# EAGLE schematic mother-002 (EAGLE 4.16)

## Sheet 1 of 15
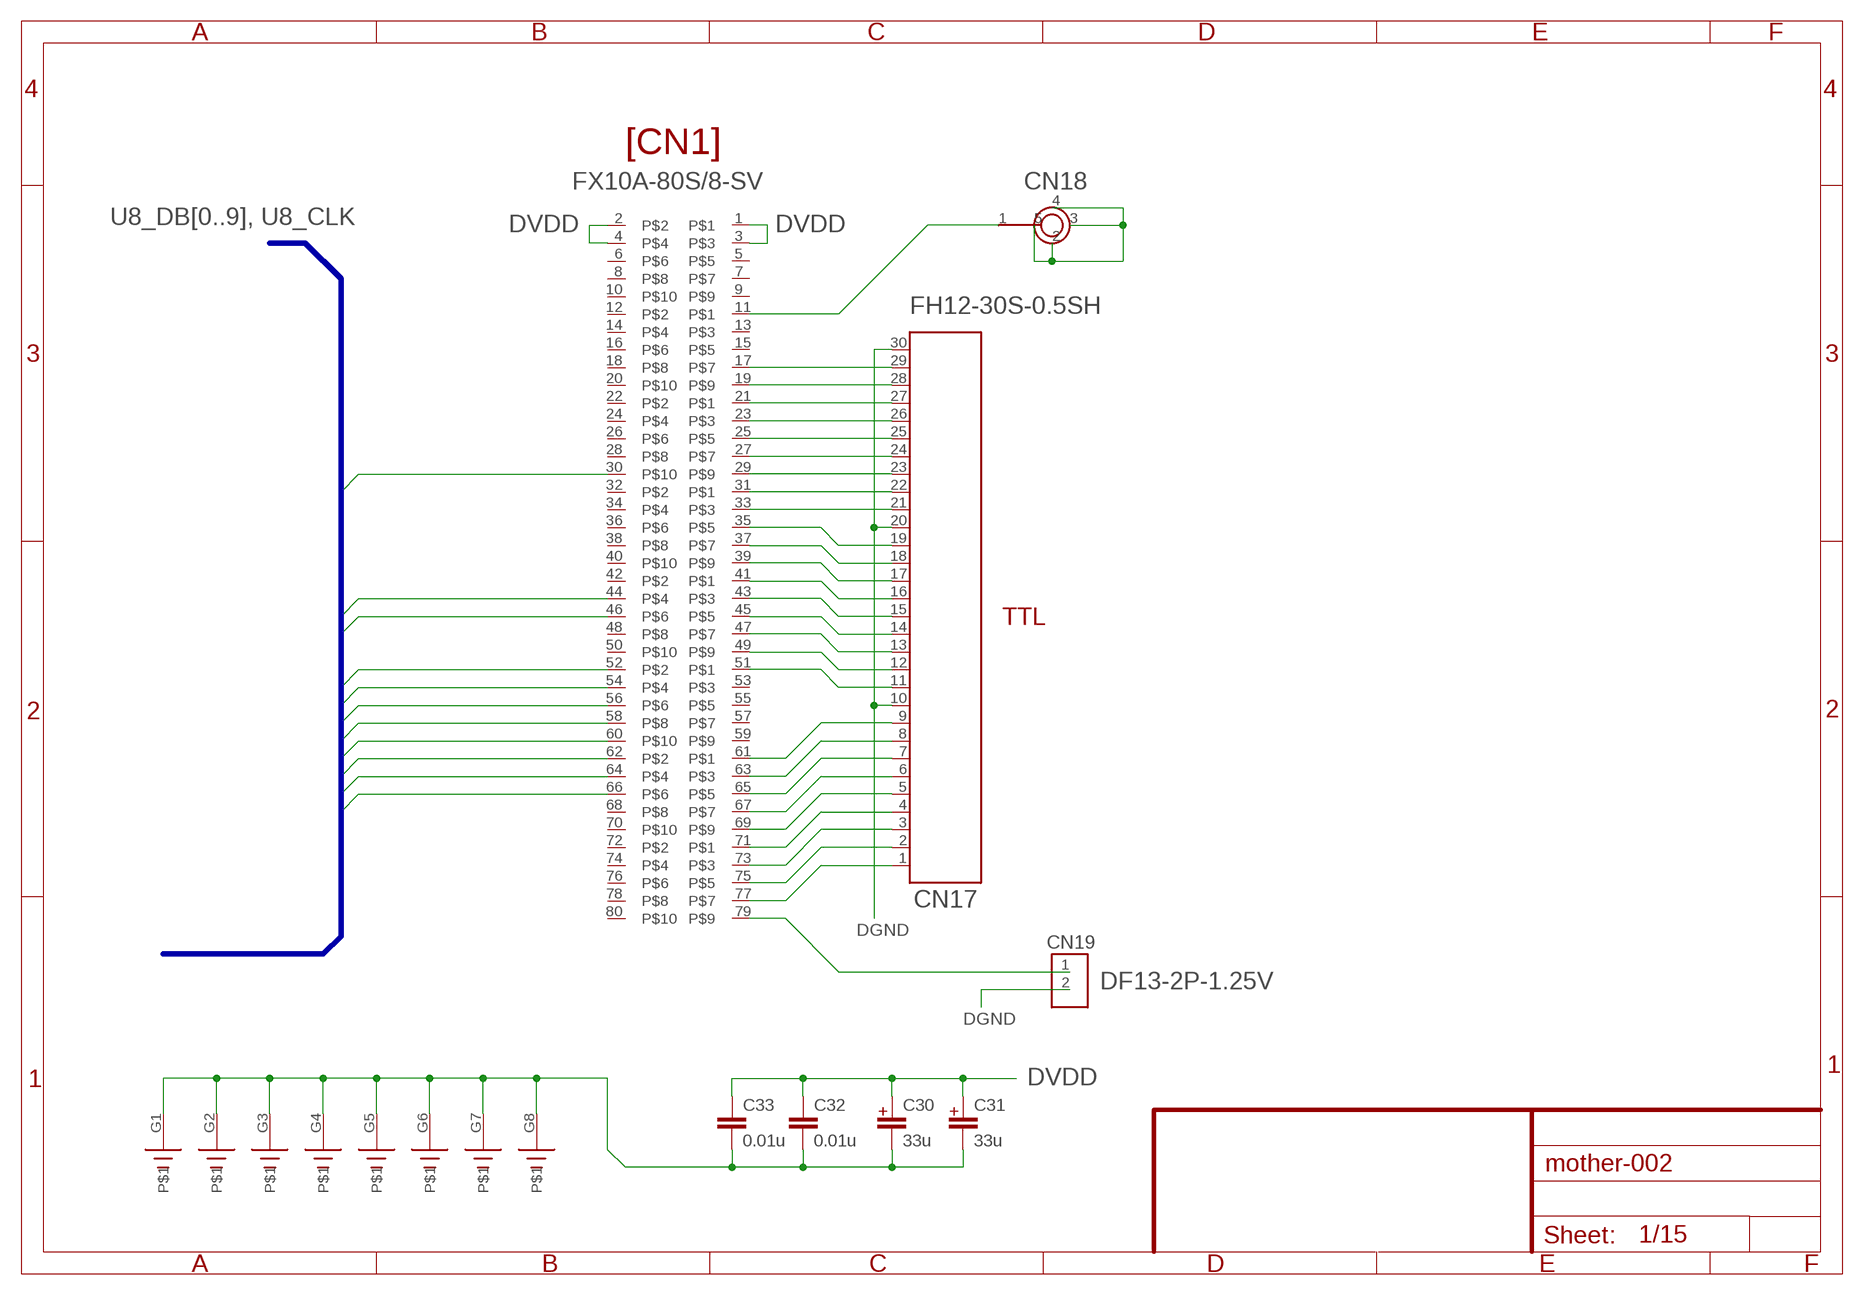
[diagram p0: schematic, sheet 1]

### Parts
C30  33u  C_POLAR  [3216_POLAR]
C31  33u  C_POLAR  [3216_POLAR]
C32  0.01u  C1608  [1608]
C33  0.01u  C1608  [1608]
CN1  FX10A-80S/8-SV  [FX10A-80S/8-SV]
CN17  FH12-30S-0.5SH  [FPC_30]
CN18  SMASTRAIGHT  [SMA_STRAIGHT]
CN19  DF13-2P-1.25V  [DF13-2P-12.5V]

### Nets
AGND: CN18.2(GND) CN18.3(GND) CN18.4(GND) CN18.5(GND) ; also sheet 3,6,7,8,9,10,11,13,14
DGND: C30.P$2 C31.P$2 C32.2 C33.2 CN1.G1 CN1.G2 CN1.G3 CN1.G4 CN1.G5 CN1.G6 CN1.G7 CN1.G8 CN17.10 CN17.20 CN17.30 CN19.2 ; also sheet 2,3,4,5,6,7,8,9,10,11,12,13,14
DVDD: C30.P$1 C31.P$1 C32.1 C33.1 CN1.1 CN1.2 CN1.3 CN1.4 ; also sheet 2,3,4,6,7,8,9,10,11,13,14
N$40: CN1.17 CN17.29
N$41: CN1.19 CN17.28
N$42: CN1.21 CN17.27
N$43: CN1.23 CN17.26
N$44: CN1.25 CN17.25
N$45: CN1.27 CN17.24
N$46: CN1.29 CN17.23
N$47: CN1.31 CN17.22
N$48: CN1.33 CN17.21
N$49: CN1.35 CN17.19
N$50: CN1.37 CN17.18
N$51: CN1.39 CN17.17
N$52: CN1.41 CN17.16
N$53: CN1.43 CN17.15
N$54: CN1.45 CN17.14
N$55: CN1.47 CN17.13
N$56: CN1.49 CN17.12
N$57: CN1.51 CN17.11
N$58: CN1.61 CN17.9
N$59: CN1.63 CN17.8
N$60: CN1.65 CN17.7
N$61: CN1.67 CN17.6
N$62: CN1.69 CN17.5
N$63: CN1.71 CN17.4
N$64: CN1.73 CN17.3
N$65: CN1.75 CN17.2
N$66: CN1.77 CN17.1
N$68: CN1.11 CN18.1
N$69: CN1.79 CN19.1
U8_CLK: CN1.30 ; also sheet 14
U8_DB0: CN1.44 ; also sheet 14
U8_DB1: CN1.46 ; also sheet 14
U8_DB2: CN1.52 ; also sheet 14
U8_DB3: CN1.54 ; also sheet 14
U8_DB4: CN1.56 ; also sheet 14
U8_DB5: CN1.58 ; also sheet 14
U8_DB6: CN1.60 ; also sheet 14
U8_DB7: CN1.62 ; also sheet 14
U8_DB8: CN1.64 ; also sheet 14
U8_DB9: CN1.66 ; also sheet 14
Unconnected: CN1.5 CN1.6 CN1.7 CN1.8 CN1.9 CN1.10 CN1.12 CN1.13 CN1.14 CN1.15 CN1.16 CN1.18 CN1.20 CN1.22 CN1.24 CN1.26 CN1.28 CN1.32 CN1.34 CN1.36 CN1.38 CN1.40 CN1.42 CN1.48 CN1.50 CN1.53 CN1.55 CN1.57 CN1.59 CN1.68 CN1.70 CN1.72 CN1.74 CN1.76 CN1.78 CN1.80

### Buses
U8_DB[0..9],U8_CLK

### Notes on the sheet
- [CN1]
- FX10A-80S/8-SV
- U8_DB[0..9], U8_CLK
- DVDD | DVDD
- TTL
- DGND
- DGND
- DVDD

## Sheet 2 of 15
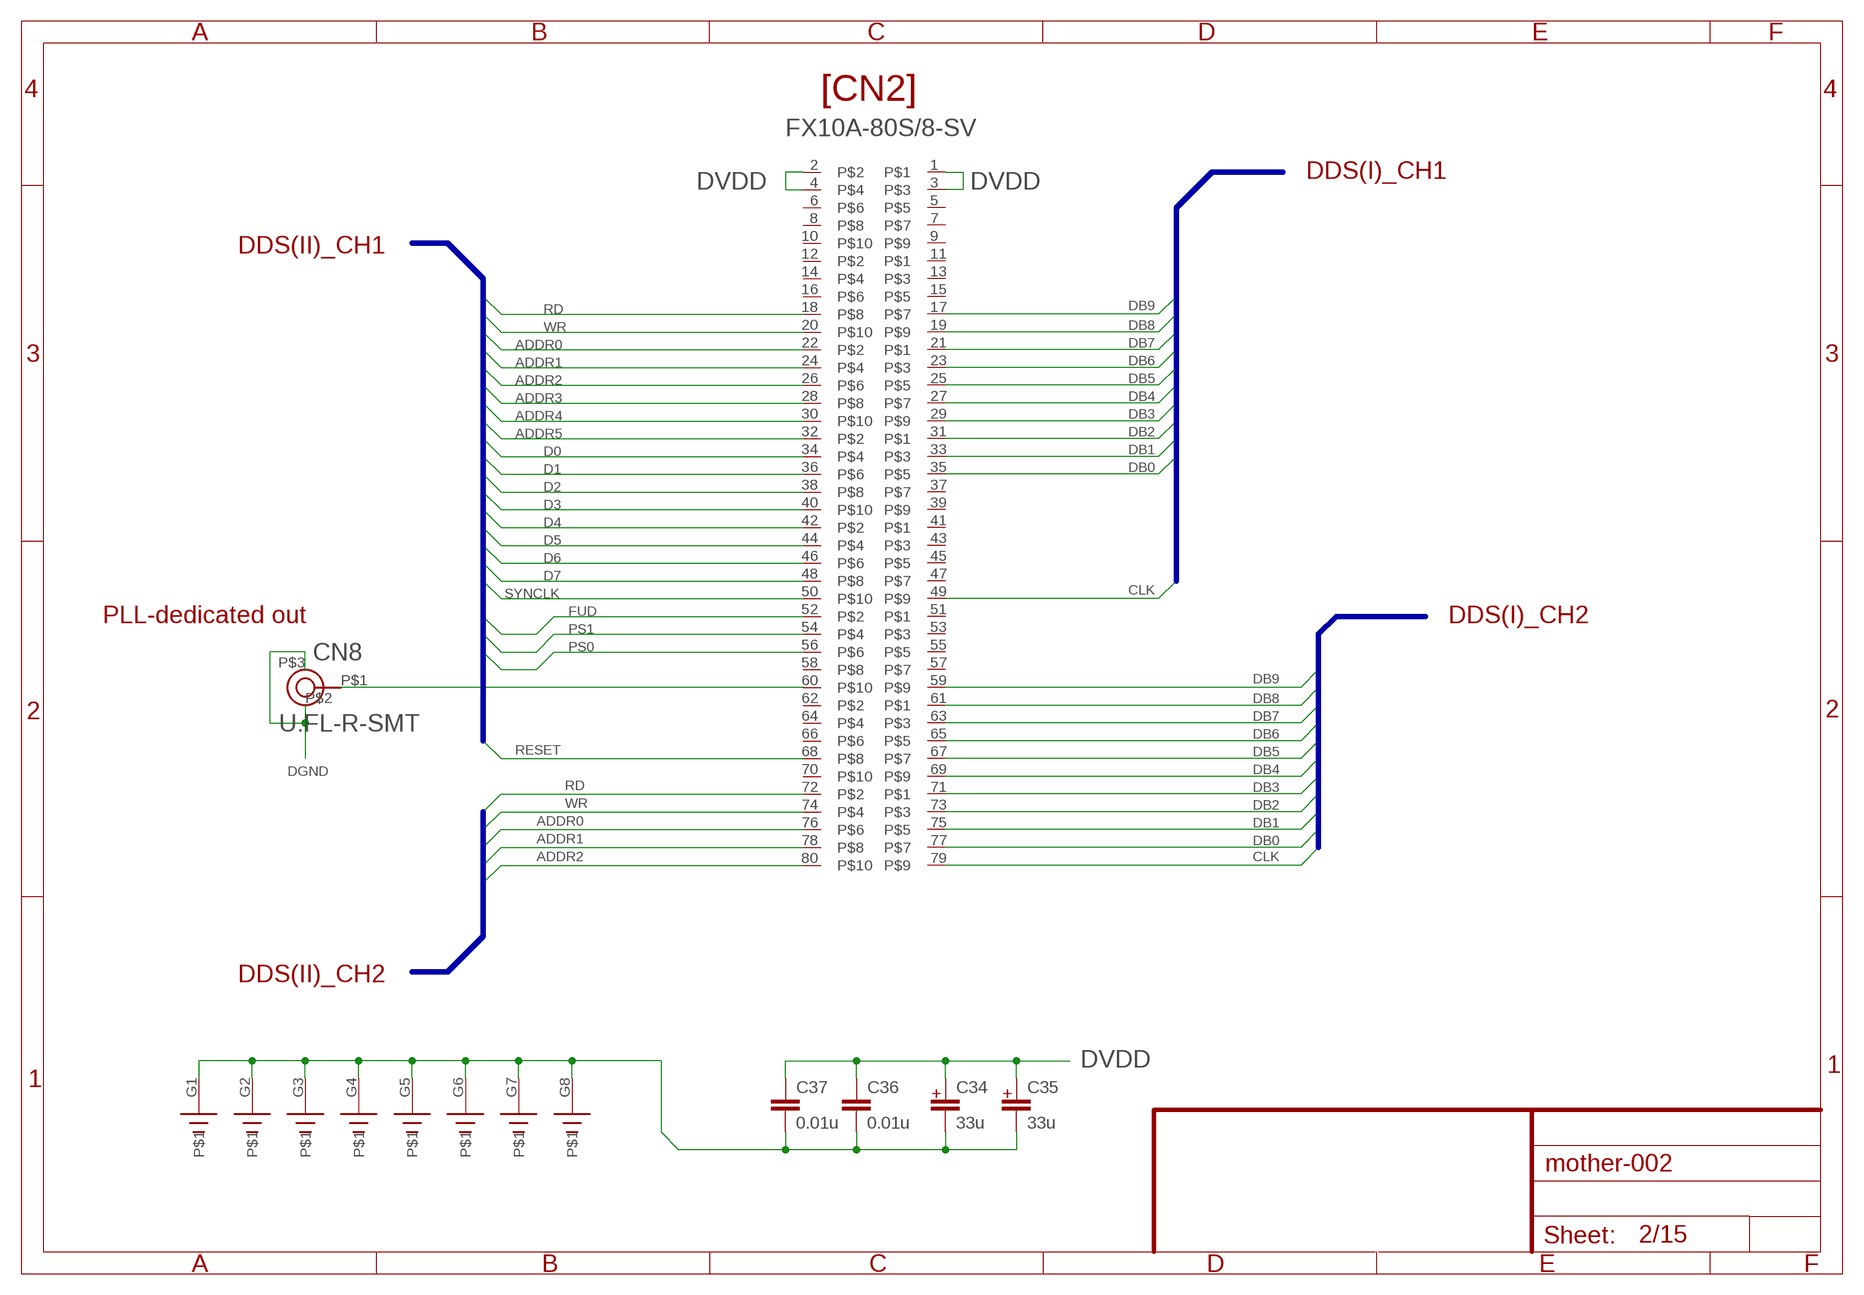
[diagram p1: schematic, sheet 2]

### Parts
C34  33u  C_POLAR  [3216_POLAR]
C35  33u  C_POLAR  [3216_POLAR]
C36  0.01u  C1608  [1608]
C37  0.01u  C1608  [1608]
CN2  FX10A-80S/8-SV  [FX10A-80S/8-SV]
CN8  U.FL-R-SMT  [U.FL-R-SMT]

### Nets
DDS2CH1_ADDR0: CN2.22 ; also sheet 12
DDS2CH1_ADDR1: CN2.24 ; also sheet 12
DDS2CH1_ADDR2: CN2.26 ; also sheet 12
DDS2CH1_ADDR3: CN2.28 ; also sheet 12
DDS2CH1_ADDR4: CN2.30 ; also sheet 12
DDS2CH1_ADDR5: CN2.32 ; also sheet 12
DDS2CH1_D0: CN2.34 ; also sheet 12
DDS2CH1_D1: CN2.36 ; also sheet 12
DDS2CH1_D2: CN2.38 ; also sheet 12
DDS2CH1_D3: CN2.40 ; also sheet 12
DDS2CH1_D4: CN2.42 ; also sheet 12
DDS2CH1_D5: CN2.44 ; also sheet 12
DDS2CH1_D6: CN2.46 ; also sheet 12
DDS2CH1_D7: CN2.48 ; also sheet 12
DDS2CH1_FUD: CN2.52 ; also sheet 12
DDS2CH1_PS0: CN2.56 ; also sheet 12
DDS2CH1_PS1: CN2.54 ; also sheet 12
DDS2CH1_RD: CN2.18 ; also sheet 12
DDS2CH1_RST: CN2.68 ; also sheet 12
DDS2CH1_SYNCLK: CN2.50 ; also sheet 12
DDS2CH1_WR: CN2.20 ; also sheet 12
DDS2CH2_ADDR0: CN2.76 ; also sheet 12
DDS2CH2_ADDR1: CN2.78 ; also sheet 12
DDS2CH2_ADDR2: CN2.80 ; also sheet 12
DDS2CH2_RD: CN2.72 ; also sheet 12
DDS2CH2_WR: CN2.74 ; also sheet 12
DGND: C34.P$2 C35.P$2 C36.2 C37.2 CN2.G1 CN2.G2 CN2.G3 CN2.G4 CN2.G5 CN2.G6 CN2.G7 CN2.G8 CN8.P$2(AGND) CN8.P$3(AGND2) ; also sheet 1,3,4,5,6,7,8,9,10,11,12,13,14
DVDD: C34.P$1 C35.P$1 C36.1 C37.1 CN2.1 CN2.2 CN2.3 CN2.4 ; also sheet 1,3,4,6,7,8,9,10,11,13,14
N$13: CN2.60 CN8.P$1
U1_CLK: CN2.49 ; also sheet 6
U1_DB0: CN2.35 ; also sheet 6
U1_DB1: CN2.33 ; also sheet 6
U1_DB2: CN2.31 ; also sheet 6
U1_DB3: CN2.29 ; also sheet 6
U1_DB4: CN2.27 ; also sheet 6
U1_DB5: CN2.25 ; also sheet 6
U1_DB6: CN2.23 ; also sheet 6
U1_DB7: CN2.21 ; also sheet 6
U1_DB8: CN2.19 ; also sheet 6
U1_DB9: CN2.17 ; also sheet 6
U2_CLK: CN2.79 ; also sheet 7
U2_DB0: CN2.77 ; also sheet 7
U2_DB1: CN2.75 ; also sheet 7
U2_DB2: CN2.73 ; also sheet 7
U2_DB3: CN2.71 ; also sheet 7
U2_DB4: CN2.69 ; also sheet 7
U2_DB5: CN2.67 ; also sheet 7
U2_DB6: CN2.65 ; also sheet 7
U2_DB7: CN2.63 ; also sheet 7
U2_DB8: CN2.61 ; also sheet 7
U2_DB9: CN2.59 ; also sheet 7
Unconnected: CN2.5 CN2.6 CN2.7 CN2.8 CN2.9 CN2.10 CN2.11 CN2.12 CN2.13 CN2.14 CN2.15 CN2.16 CN2.37 CN2.39 CN2.41 CN2.43 CN2.45 CN2.47 CN2.51 CN2.53 CN2.55 CN2.57 CN2.58 CN2.62 CN2.64 CN2.66 CN2.70

### Buses
BUS1:U1_DB[0..9],U1_CLK
DDS2CH1_RST,DDS2CH1_PS[0..1],DDS2CH1_FUD,DDS2CH1_SYNCLK,DDS2CH1_D[0..7],DDS2CH1_ADDR[0..5],DDS2CH1_WR,DDS2CH1_RD
U2_DB[0..9],U2_CLK
DDS2CH2_RST,DDS2CH2_PS[0..1],DDS2CH2_FUD,DDS2CH2_SYNCLK,DDS2CH2_D[0..7],DDS2CH2_ADDR[0..5],DDS2CH2_WR,DDS2CH2_RD

### Notes on the sheet
- [CN2]
- FX10A-80S/8-SV
- DDS(I)_CH1
- DVDD | DVDD
- DDS(II)_CH1
- RD | DB9
- WR | DB8
- ADDR0 | DB7
- ADDR1 | DB6
- ADDR2 | DB5
- ADDR3 | DB4
- ADDR4 | DB3
- ADDR5 | DB2
- D0 | DB1
- D1 | DB0
- D2
- D3
- D4
- D5
- D6
- D7
- SYNCLK | CLK
- FUD
- PLL-dedicated out | DDS(I)_CH2
- PS1
- PS0
- DB9
- DB8
- DB7
- DB6
- RESET | DB5
- DGND | DB4
- RD | DB3
- WR | DB2
- ADDR0 | DB1
- ADDR1 | DB0
- ADDR2 | CLK
- DDS(II)_CH2
- DVDD

## Sheet 3 of 15
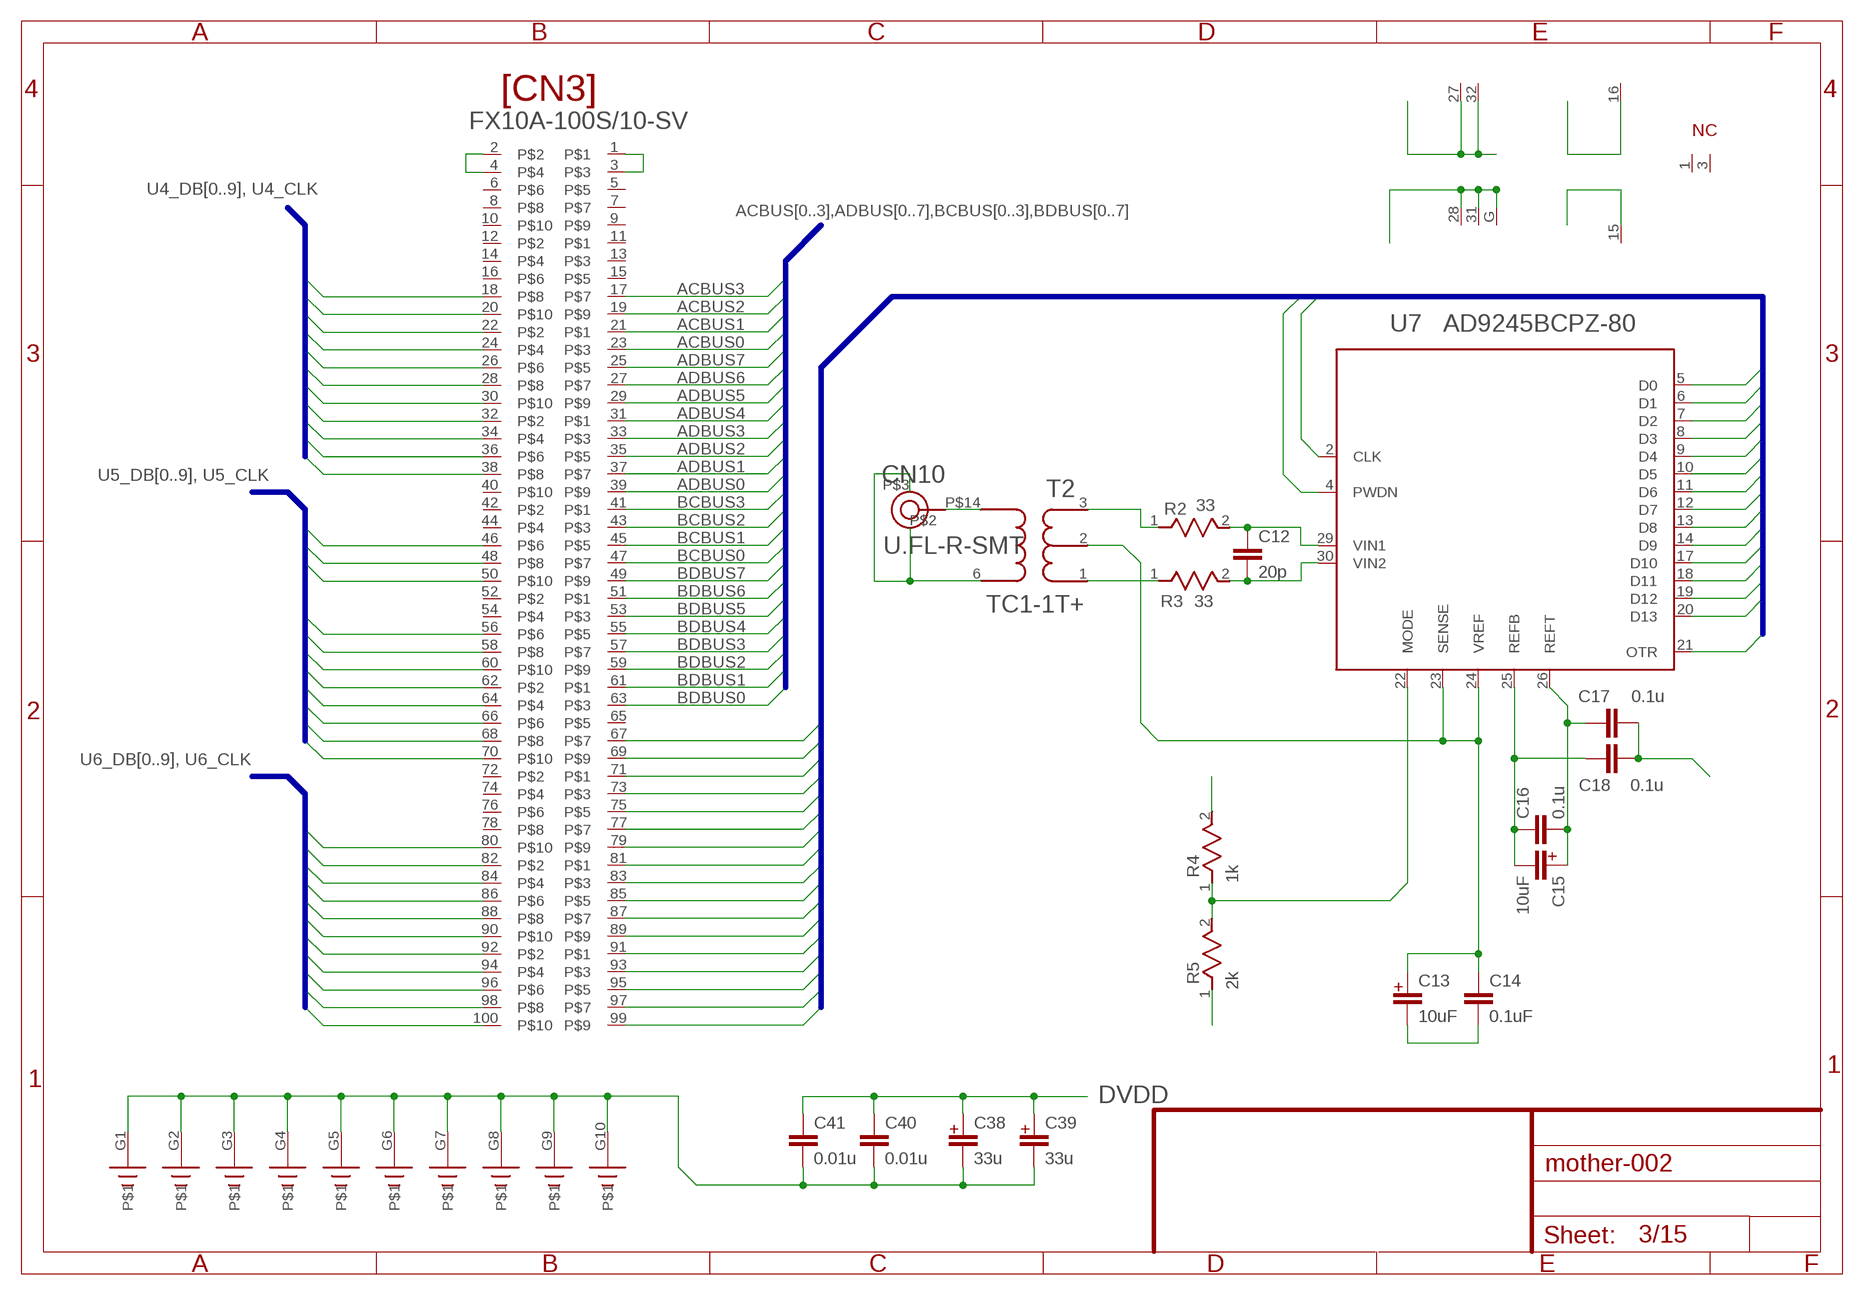
[diagram p2: schematic, sheet 3]

### Parts
C12  20p  C1005  [1005]
C13  10uF  C_POLAR  [3216_POLAR]
C14  0.1uF  C1005  [1005]
C15  10uF  C_POLAR  [3216_POLAR]
C16  0.1u  C1005  [1005]
C17  0.1u  C1005  [1005]
C18  0.1u  C1005  [1005]
C38  33u  C_POLAR  [3216_POLAR]
C39  33u  C_POLAR  [3216_POLAR]
C40  0.01u  C1608  [1608]
C41  0.01u  C1608  [1608]
CN3  FX10A-100S/10-SV  [FX10A-100S/10-SV]
CN10  U.FL-R-SMT  [U.FL-R-SMT]
R2  33  R1005  [1005]
R3  33  R1005  [1005]
R4  1k  R1005  [1005]
R5  2k  R1005  [1005]
T2  TC1-1T+  [AT224]
U7  AD9245BCPZ-80  AD9245  [AD9245]

### Nets
ACBUS0: CN3.23 ; also sheet 5
ACBUS1: CN3.21 ; also sheet 5
ACBUS2: CN3.19 ; also sheet 5
ACBUS3: CN3.17 ; also sheet 5
ADBUS0: CN3.39 ; also sheet 5
ADBUS1: CN3.37 ; also sheet 5
ADBUS2: CN3.35 ; also sheet 5
ADBUS3: CN3.33 ; also sheet 5
ADBUS4: CN3.31 ; also sheet 5
ADBUS5: CN3.29 ; also sheet 5
ADBUS6: CN3.27 ; also sheet 5
ADBUS7: CN3.25 ; also sheet 5
ADC_CLK: CN3.67 U7.2(CLK)
ADC_D0: CN3.71 U7.5(D0)
ADC_D1: CN3.73 U7.6(D1)
ADC_D2: CN3.75 U7.7(D2)
ADC_D3: CN3.77 U7.8(D3)
ADC_D4: CN3.79 U7.9(D4)
ADC_D5: CN3.81 U7.10(D5)
ADC_D6: CN3.83 U7.11(D6)
ADC_D7: CN3.85 U7.12(D7)
ADC_D8: CN3.87 U7.13(D8)
ADC_D9: CN3.89 U7.14(D9)
ADC_D10: CN3.91 U7.17(D10)
ADC_D11: CN3.93 U7.18(D11)
ADC_D12: CN3.95 U7.19(D12)
ADC_D13: CN3.97 U7.20(D13)
ADC_OTR: CN3.99 U7.21(OTR)
ADC_PWDN: CN3.69 U7.4(PWDN)
AGND: C13.P$2 C14.2 C17.2 C18.2 CN10.P$2(AGND) CN10.P$3(AGND2) R5.1 T2.6 U7.28(AGND) U7.31(AGND) U7.G(AGND) ; also sheet 1,6,7,8,9,10,11,13,14
AVDD: R4.2 U7.27(AVDD) U7.32(AVDD) ; also sheet 6,7,8,9,10,11,13,14
BCBUS0: CN3.47 ; also sheet 5
BCBUS1: CN3.45 ; also sheet 5
BCBUS2: CN3.43 ; also sheet 5
BCBUS3: CN3.41 ; also sheet 5
BDBUS0: CN3.63 ; also sheet 5
BDBUS1: CN3.61 ; also sheet 5
BDBUS2: CN3.59 ; also sheet 5
BDBUS3: CN3.57 ; also sheet 5
BDBUS4: CN3.55 ; also sheet 5
BDBUS5: CN3.53 ; also sheet 5
BDBUS6: CN3.51 ; also sheet 5
BDBUS7: CN3.49 ; also sheet 5
DGND: C38.P$2 C39.P$2 C40.2 C41.2 CN3.G1 CN3.G2 CN3.G3 CN3.G4 CN3.G5 CN3.G6 CN3.G7 CN3.G8 CN3.G9 CN3.G10 U7.15(DGND) ; also sheet 1,2,4,5,6,7,8,9,10,11,12,13,14
DVDD: C38.P$1 C39.P$1 C40.1 C41.1 CN3.1 CN3.2 CN3.3 CN3.4 U7.16(DVDD) ; also sheet 1,2,4,6,7,8,9,10,11,13,14
N$2: C12.1 R2.2 U7.29(VIN1)
N$3: C12.2 R3.2 U7.30(VIN2)
N$5: R2.1 T2.3
N$7: R3.1 T2.1
N$8: C13.P$1 C14.1 T2.2 U7.23(SENSE) U7.24(VREF)
N$12: CN10.P$1 T2.4
N$14: R4.1 R5.2 U7.22(MODE)
N$15: C15.P$1 C16.2 C17.1 U7.26(REFT)
N$16: C15.P$2 C16.1 C18.1 U7.25(REFB)
U4_CLK: CN3.18 ; also sheet 9
U4_DB0: CN3.20 ; also sheet 9
U4_DB1: CN3.22 ; also sheet 9
U4_DB2: CN3.24 ; also sheet 9
U4_DB3: CN3.26 ; also sheet 9
U4_DB4: CN3.28 ; also sheet 9
U4_DB5: CN3.30 ; also sheet 9
U4_DB6: CN3.32 ; also sheet 9
U4_DB7: CN3.34 ; also sheet 9
U4_DB8: CN3.36 ; also sheet 9
U4_DB9: CN3.38 ; also sheet 9
U5_CLK: CN3.46 ; also sheet 10
U5_DB0: CN3.48 ; also sheet 10
U5_DB1: CN3.50 ; also sheet 10
U5_DB2: CN3.56 ; also sheet 10
U5_DB3: CN3.58 ; also sheet 10
U5_DB4: CN3.60 ; also sheet 10
U5_DB5: CN3.62 ; also sheet 10
U5_DB6: CN3.64 ; also sheet 10
U5_DB7: CN3.66 ; also sheet 10
U5_DB8: CN3.68 ; also sheet 10
U5_DB9: CN3.70 ; also sheet 10
U6_CLK: CN3.80 ; also sheet 11
U6_DB0: CN3.82 ; also sheet 11
U6_DB1: CN3.84 ; also sheet 11
U6_DB2: CN3.86 ; also sheet 11
U6_DB3: CN3.88 ; also sheet 11
U6_DB4: CN3.90 ; also sheet 11
U6_DB5: CN3.92 ; also sheet 11
U6_DB6: CN3.94 ; also sheet 11
U6_DB7: CN3.96 ; also sheet 11
U6_DB8: CN3.98 ; also sheet 11
U6_DB9: CN3.100 ; also sheet 11
Unconnected: CN3.5 CN3.6 CN3.7 CN3.8 CN3.9 CN3.10 CN3.11 CN3.12 CN3.13 CN3.14 CN3.15 CN3.16 CN3.40 CN3.42 CN3.44 CN3.52 CN3.54 CN3.65 CN3.72 CN3.74 CN3.76 CN3.78 U7.1(NC) U7.3(NC)

### Buses
ADC_D[0..13],ADC_CLK,ADC_OTR,ADC_PWDN
U4_DB[0..9],U4_CLK
U5_DB[0..9],U5_CLK
U6_DB[0..9],U6_CLK
ACBUS[0..3],ADBUS[0..7],BCBUS[0..3],BDBUS[0..7]

### Notes on the sheet
- [CN3]
- FX10A-100S/10-SV
- NC
- U4_DB[0..9], U4_CLK
- ACBUS[0..3],ADBUS[0..7],BCBUS[0..3],BDBUS[0..7]
- ACBUS3
- ACBUS2
- ACBUS1
- ACBUS0
- ADBUS7
- ADBUS6
- ADBUS5
- ADBUS4
- ADBUS3
- ADBUS2
- ADBUS1
- U5_DB[0..9], U5_CLK
- ADBUS0
- BCBUS3
- BCBUS2
- BCBUS1
- BCBUS0
- BDBUS7
- BDBUS6
- BDBUS5
- BDBUS4
- BDBUS3
- BDBUS2
- BDBUS1
- BDBUS0
- U6_DB[0..9], U6_CLK
- DVDD

## Sheet 4 of 15
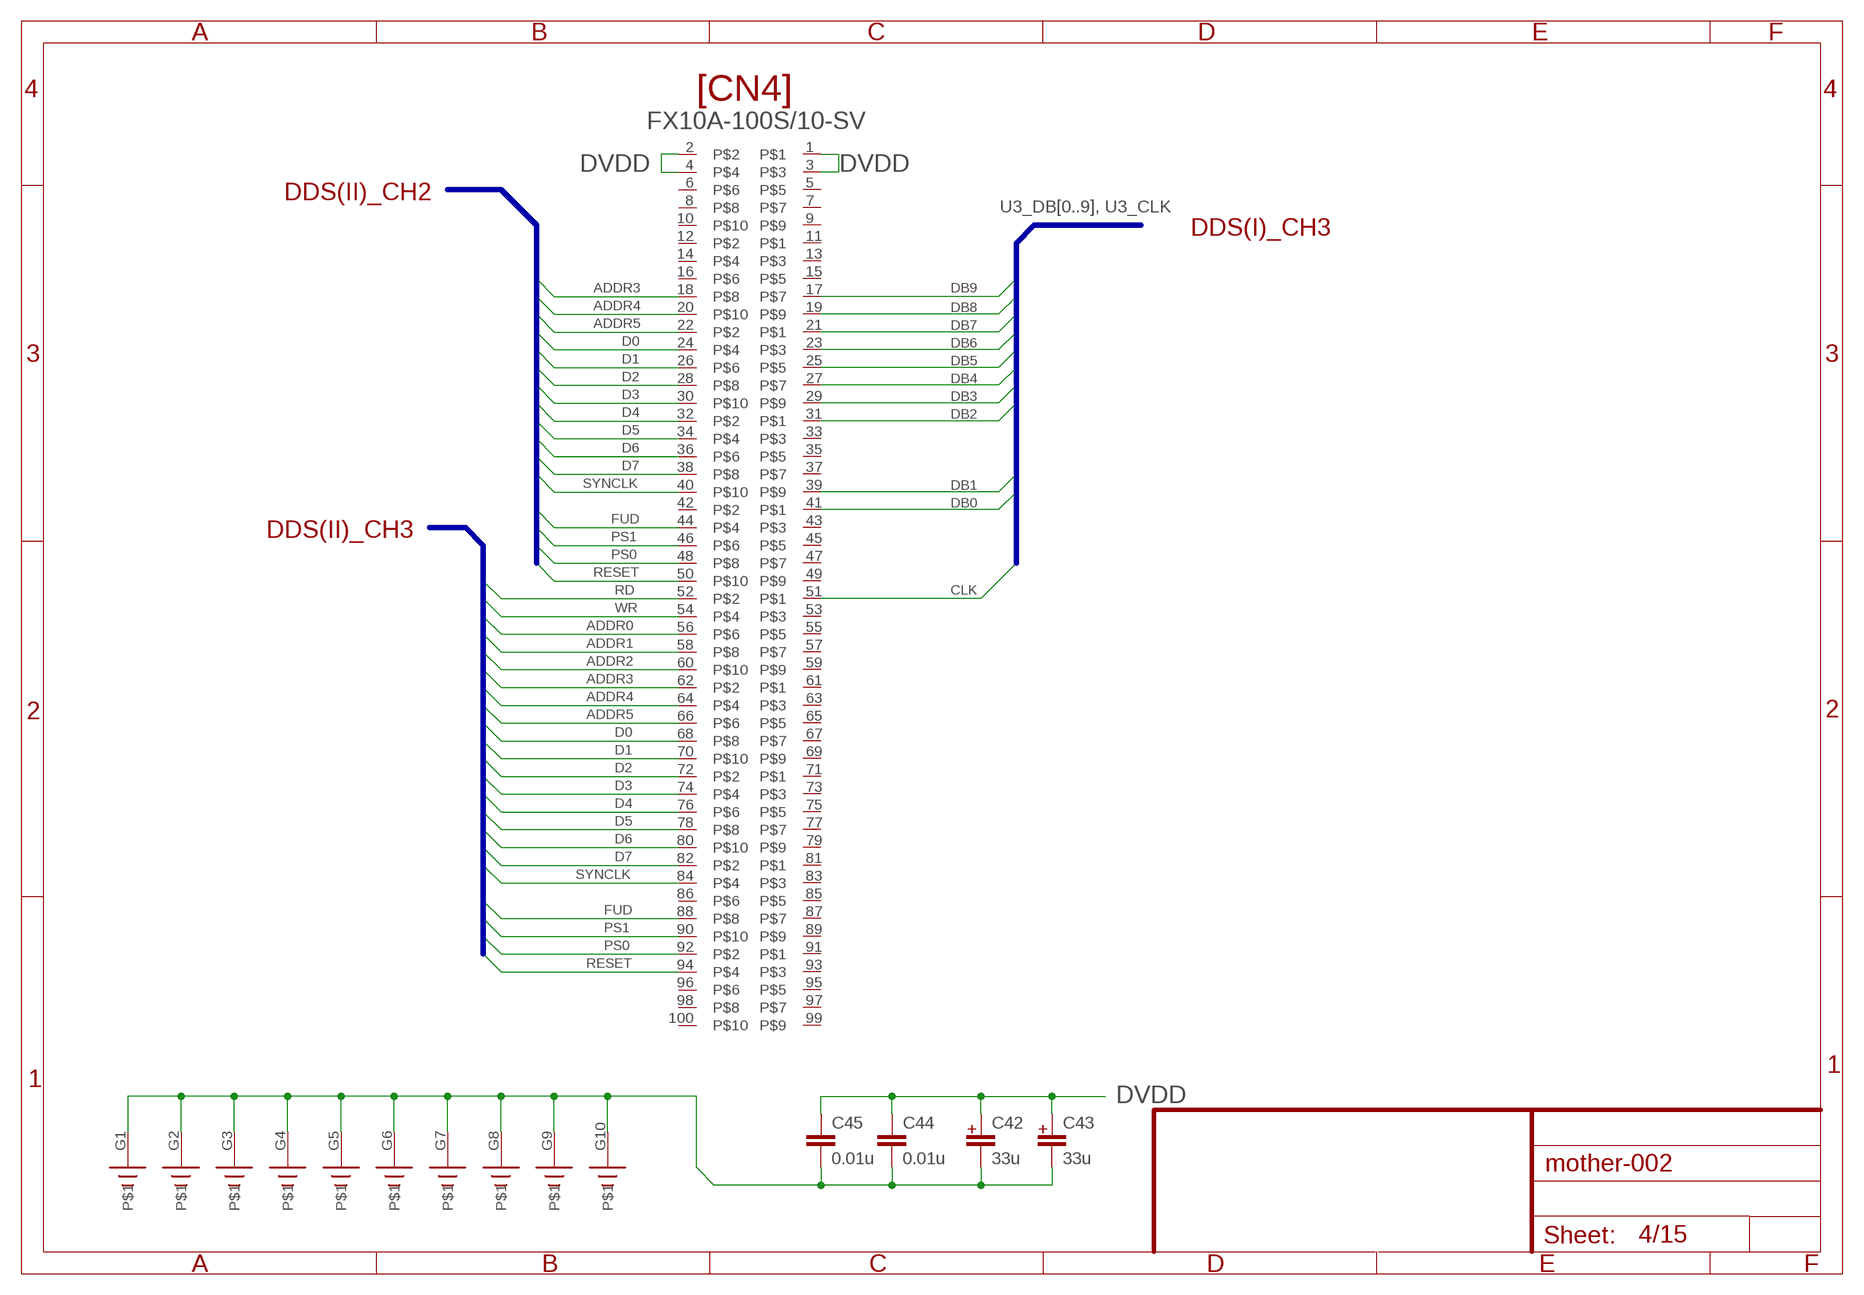
[diagram p3: schematic, sheet 4]

### Parts
C42  33u  C_POLAR  [3216_POLAR]
C43  33u  C_POLAR  [3216_POLAR]
C44  0.01u  C1608  [1608]
C45  0.01u  C1608  [1608]
CN4  FX10A-100S/10-SV  [FX10A-100S/10-SV]

### Nets
DDS2CH2_ADDR3: CN4.18 ; also sheet 12
DDS2CH2_ADDR4: CN4.20 ; also sheet 12
DDS2CH2_ADDR5: CN4.22 ; also sheet 12
DDS2CH2_D0: CN4.24 ; also sheet 12
DDS2CH2_D1: CN4.26 ; also sheet 12
DDS2CH2_D2: CN4.28 ; also sheet 12
DDS2CH2_D3: CN4.30 ; also sheet 12
DDS2CH2_D4: CN4.32 ; also sheet 12
DDS2CH2_D5: CN4.34 ; also sheet 12
DDS2CH2_D6: CN4.36 ; also sheet 12
DDS2CH2_D7: CN4.38 ; also sheet 12
DDS2CH2_FUD: CN4.44 ; also sheet 12
DDS2CH2_PS0: CN4.48 ; also sheet 12
DDS2CH2_PS1: CN4.46 ; also sheet 12
DDS2CH2_RST: CN4.50 ; also sheet 12
DDS2CH2_SYNCLK: CN4.40 ; also sheet 12
DDS2CH3_ADDR0: CN4.56 ; also sheet 12
DDS2CH3_ADDR1: CN4.58 ; also sheet 12
DDS2CH3_ADDR2: CN4.60 ; also sheet 12
DDS2CH3_ADDR3: CN4.62 ; also sheet 12
DDS2CH3_ADDR4: CN4.64 ; also sheet 12
DDS2CH3_ADDR5: CN4.66 ; also sheet 12
DDS2CH3_D0: CN4.68 ; also sheet 12
DDS2CH3_D1: CN4.70 ; also sheet 12
DDS2CH3_D2: CN4.72 ; also sheet 12
DDS2CH3_D3: CN4.74 ; also sheet 12
DDS2CH3_D4: CN4.76 ; also sheet 12
DDS2CH3_D5: CN4.78 ; also sheet 12
DDS2CH3_D6: CN4.80 ; also sheet 12
DDS2CH3_D7: CN4.82 ; also sheet 12
DDS2CH3_FUD: CN4.88 ; also sheet 12
DDS2CH3_PS0: CN4.92 ; also sheet 12
DDS2CH3_PS1: CN4.90 ; also sheet 12
DDS2CH3_RD: CN4.52 ; also sheet 12
DDS2CH3_RST: CN4.94 ; also sheet 12
DDS2CH3_SYNCLK: CN4.84 ; also sheet 12
DDS2CH3_WR: CN4.54 ; also sheet 12
DGND: C42.P$2 C43.P$2 C44.2 C45.2 CN4.G1 CN4.G2 CN4.G3 CN4.G4 CN4.G5 CN4.G6 CN4.G7 CN4.G8 CN4.G9 CN4.G10 ; also sheet 1,2,3,5,6,7,8,9,10,11,12,13,14
DVDD: C42.P$1 C43.P$1 C44.1 C45.1 CN4.1 CN4.2 CN4.3 CN4.4 ; also sheet 1,2,3,6,7,8,9,10,11,13,14
U3_CLK: CN4.51 ; also sheet 8
U3_DB0: CN4.41 ; also sheet 8
U3_DB1: CN4.39 ; also sheet 8
U3_DB2: CN4.31 ; also sheet 8
U3_DB3: CN4.29 ; also sheet 8
U3_DB4: CN4.27 ; also sheet 8
U3_DB5: CN4.25 ; also sheet 8
U3_DB6: CN4.23 ; also sheet 8
U3_DB7: CN4.21 ; also sheet 8
U3_DB8: CN4.19 ; also sheet 8
U3_DB9: CN4.17 ; also sheet 8
Unconnected: CN4.5 CN4.6 CN4.7 CN4.8 CN4.9 CN4.10 CN4.11 CN4.12 CN4.13 CN4.14 CN4.15 CN4.16 CN4.33 CN4.35 CN4.37 CN4.42 CN4.43 CN4.45 CN4.47 CN4.49 CN4.53 CN4.55 CN4.57 CN4.59 CN4.61 CN4.63 CN4.65 CN4.67 CN4.69 CN4.71 CN4.73 CN4.75 CN4.77 CN4.79 CN4.81 CN4.83 CN4.85 CN4.86 CN4.87 CN4.89 CN4.91 CN4.93 CN4.95 CN4.96 CN4.97 CN4.98 CN4.99 CN4.100

### Buses
DDS2CH2_RST,DDS2CH2_PS[0..1],DDS2CH2_FUD,DDS2CH2_SYNCLK,DDS2CH2_D[0..7],DDS2CH2_ADDR[0..5],DDS2CH2_WR,DDS2CH2_RD
DDS2CH3_RST,DDS2CH3_PS[0..1],DDS2CH3_FUD,DDS2CH3_SYNCLK,DDS2CH3_D[0..7],DDS2CH3_ADDR[0..5],DDS2CH3_WR,DDS2CH3_RD
U3_DB[0..9],U3_CLK

### Notes on the sheet
- [CN4]
- FX10A-100S/10-SV
- DVDD | DVDD
- DDS(II)_CH2 | U3_DB[0..9], U3_CLK
- DDS(I)_CH3
- ADDR3 | DB9
- ADDR4 | DB8
- ADDR5 | DB7
- D0 | DB6
- D1 | DB5
- D2 | DB4
- D3 | DB3
- D4 | DB2
- D5
- D6
- D7
- SYNCLK | DB1
- DB0
- FUD
- DDS(II)_CH3 | PS1
- PS0
- RESET
- RD | CLK
- WR
- ADDR0
- ADDR1
- ADDR2
- ADDR3
- ADDR4
- ADDR5
- D0
- D1
- D2
- D3
- D4
- D5
- D6
- D7
- SYNCLK
- FUD
- PS1
- PS0
- RESET
- DVDD

## Sheet 5 of 15
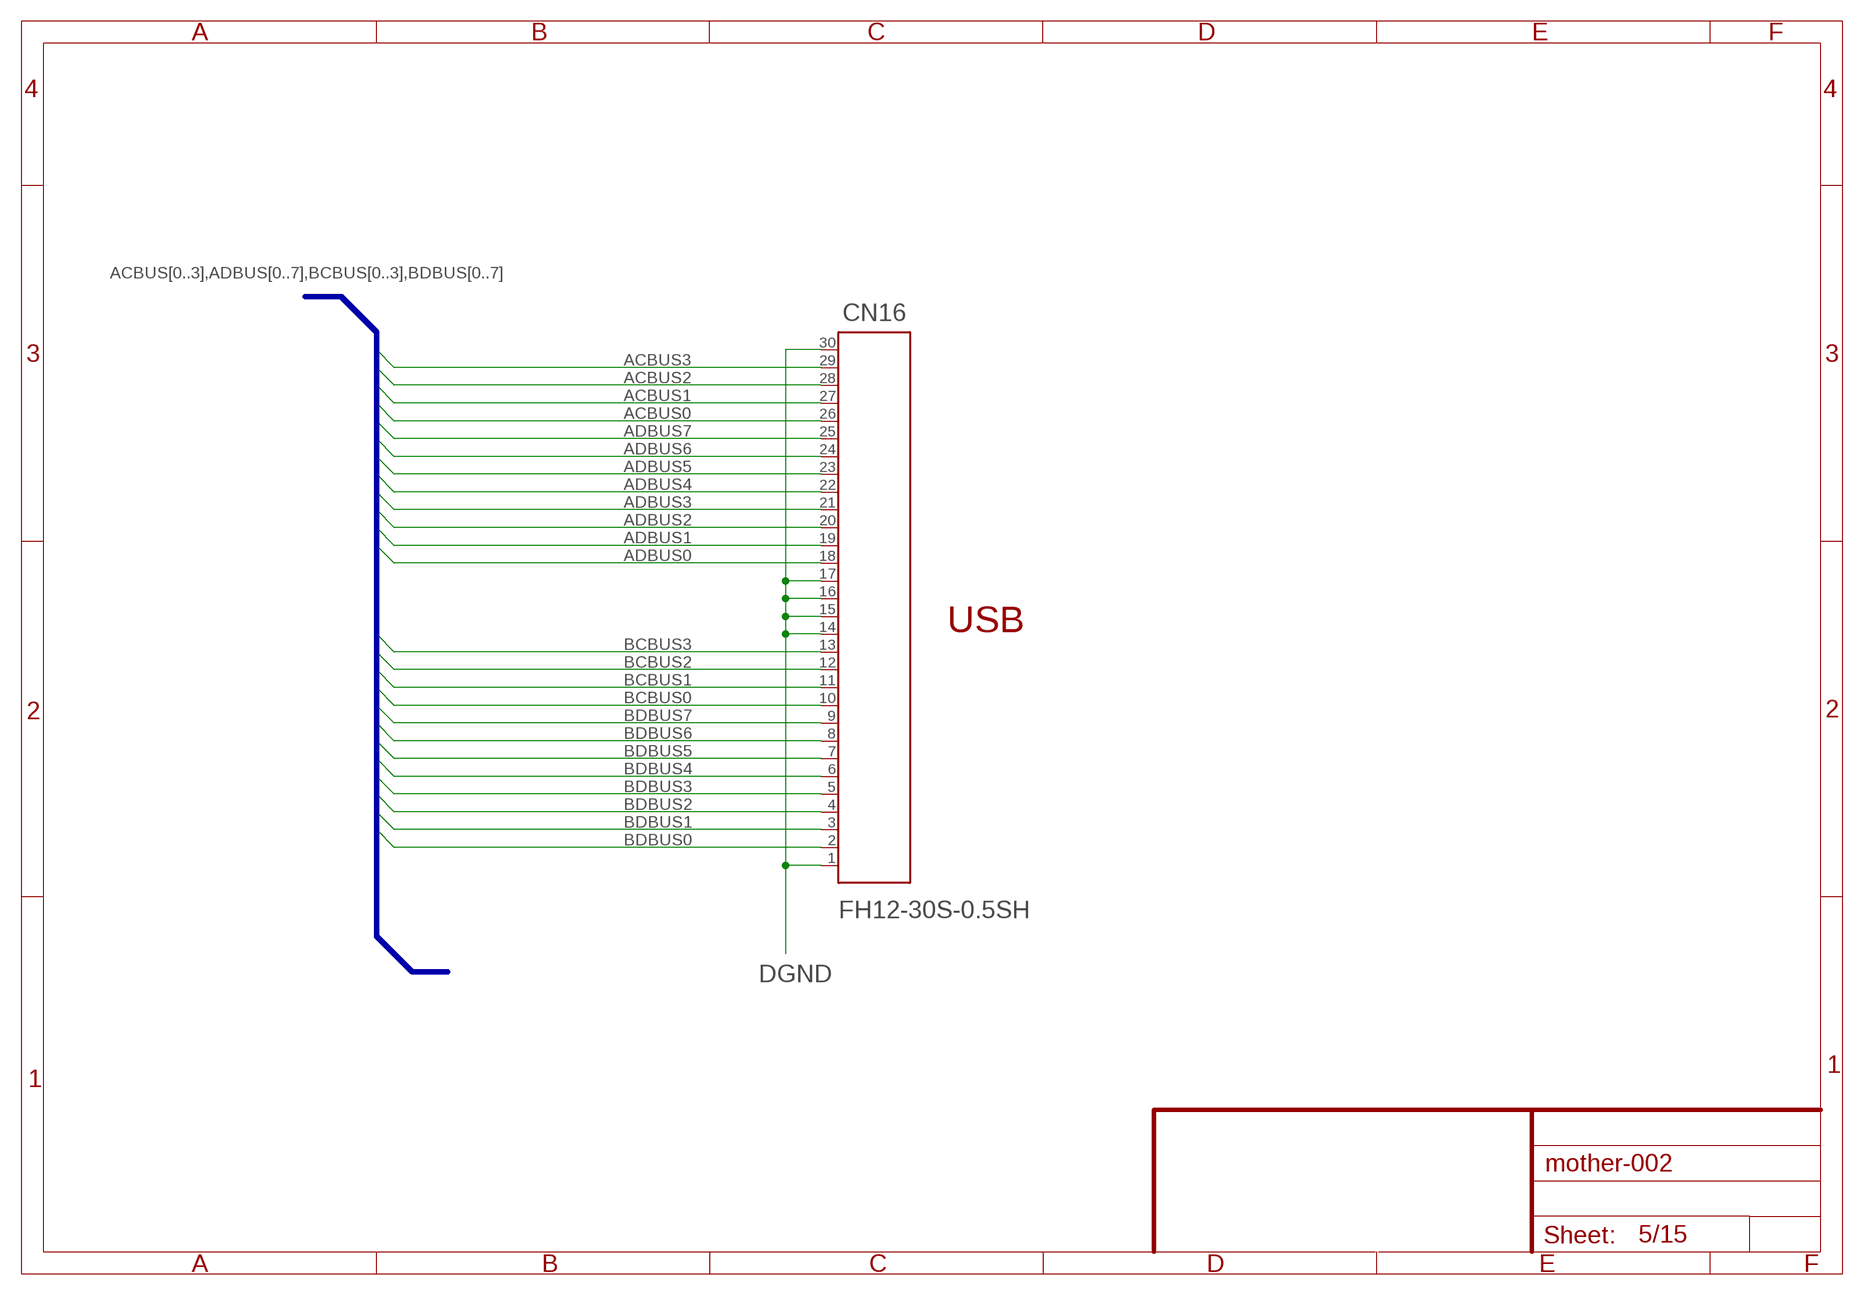
[diagram p4: schematic, sheet 5]

### Parts
CN16  FH12-30S-0.5SH  [FPC_30]

### Nets
ACBUS0: CN16.26 ; also sheet 3
ACBUS1: CN16.27 ; also sheet 3
ACBUS2: CN16.28 ; also sheet 3
ACBUS3: CN16.29 ; also sheet 3
ADBUS0: CN16.18 ; also sheet 3
ADBUS1: CN16.19 ; also sheet 3
ADBUS2: CN16.20 ; also sheet 3
ADBUS3: CN16.21 ; also sheet 3
ADBUS4: CN16.22 ; also sheet 3
ADBUS5: CN16.23 ; also sheet 3
ADBUS6: CN16.24 ; also sheet 3
ADBUS7: CN16.25 ; also sheet 3
BCBUS0: CN16.10 ; also sheet 3
BCBUS1: CN16.11 ; also sheet 3
BCBUS2: CN16.12 ; also sheet 3
BCBUS3: CN16.13 ; also sheet 3
BDBUS0: CN16.2 ; also sheet 3
BDBUS1: CN16.3 ; also sheet 3
BDBUS2: CN16.4 ; also sheet 3
BDBUS3: CN16.5 ; also sheet 3
BDBUS4: CN16.6 ; also sheet 3
BDBUS5: CN16.7 ; also sheet 3
BDBUS6: CN16.8 ; also sheet 3
BDBUS7: CN16.9 ; also sheet 3
DGND: CN16.1 CN16.14 CN16.15 CN16.16 CN16.17 CN16.30 ; also sheet 1,2,3,4,6,7,8,9,10,11,12,13,14

### Buses
ACBUS[0..3],ADBUS[0..7],BCBUS[0..3],BDBUS[0..7]

### Notes on the sheet
- ACBUS[0..3],ADBUS[0..7],BCBUS[0..3],BDBUS[0..7]
- ACBUS3
- ACBUS2
- ACBUS1
- ACBUS0
- ADBUS7
- ADBUS6
- ADBUS5
- ADBUS4
- ADBUS3
- ADBUS2
- ADBUS1
- ADBUS0
- USB
- BCBUS3
- BCBUS2
- BCBUS1
- BCBUS0
- BDBUS7
- BDBUS6
- BDBUS5
- BDBUS4
- BDBUS3
- BDBUS2
- BDBUS1
- BDBUS0
- DGND

## Sheet 6 of 15
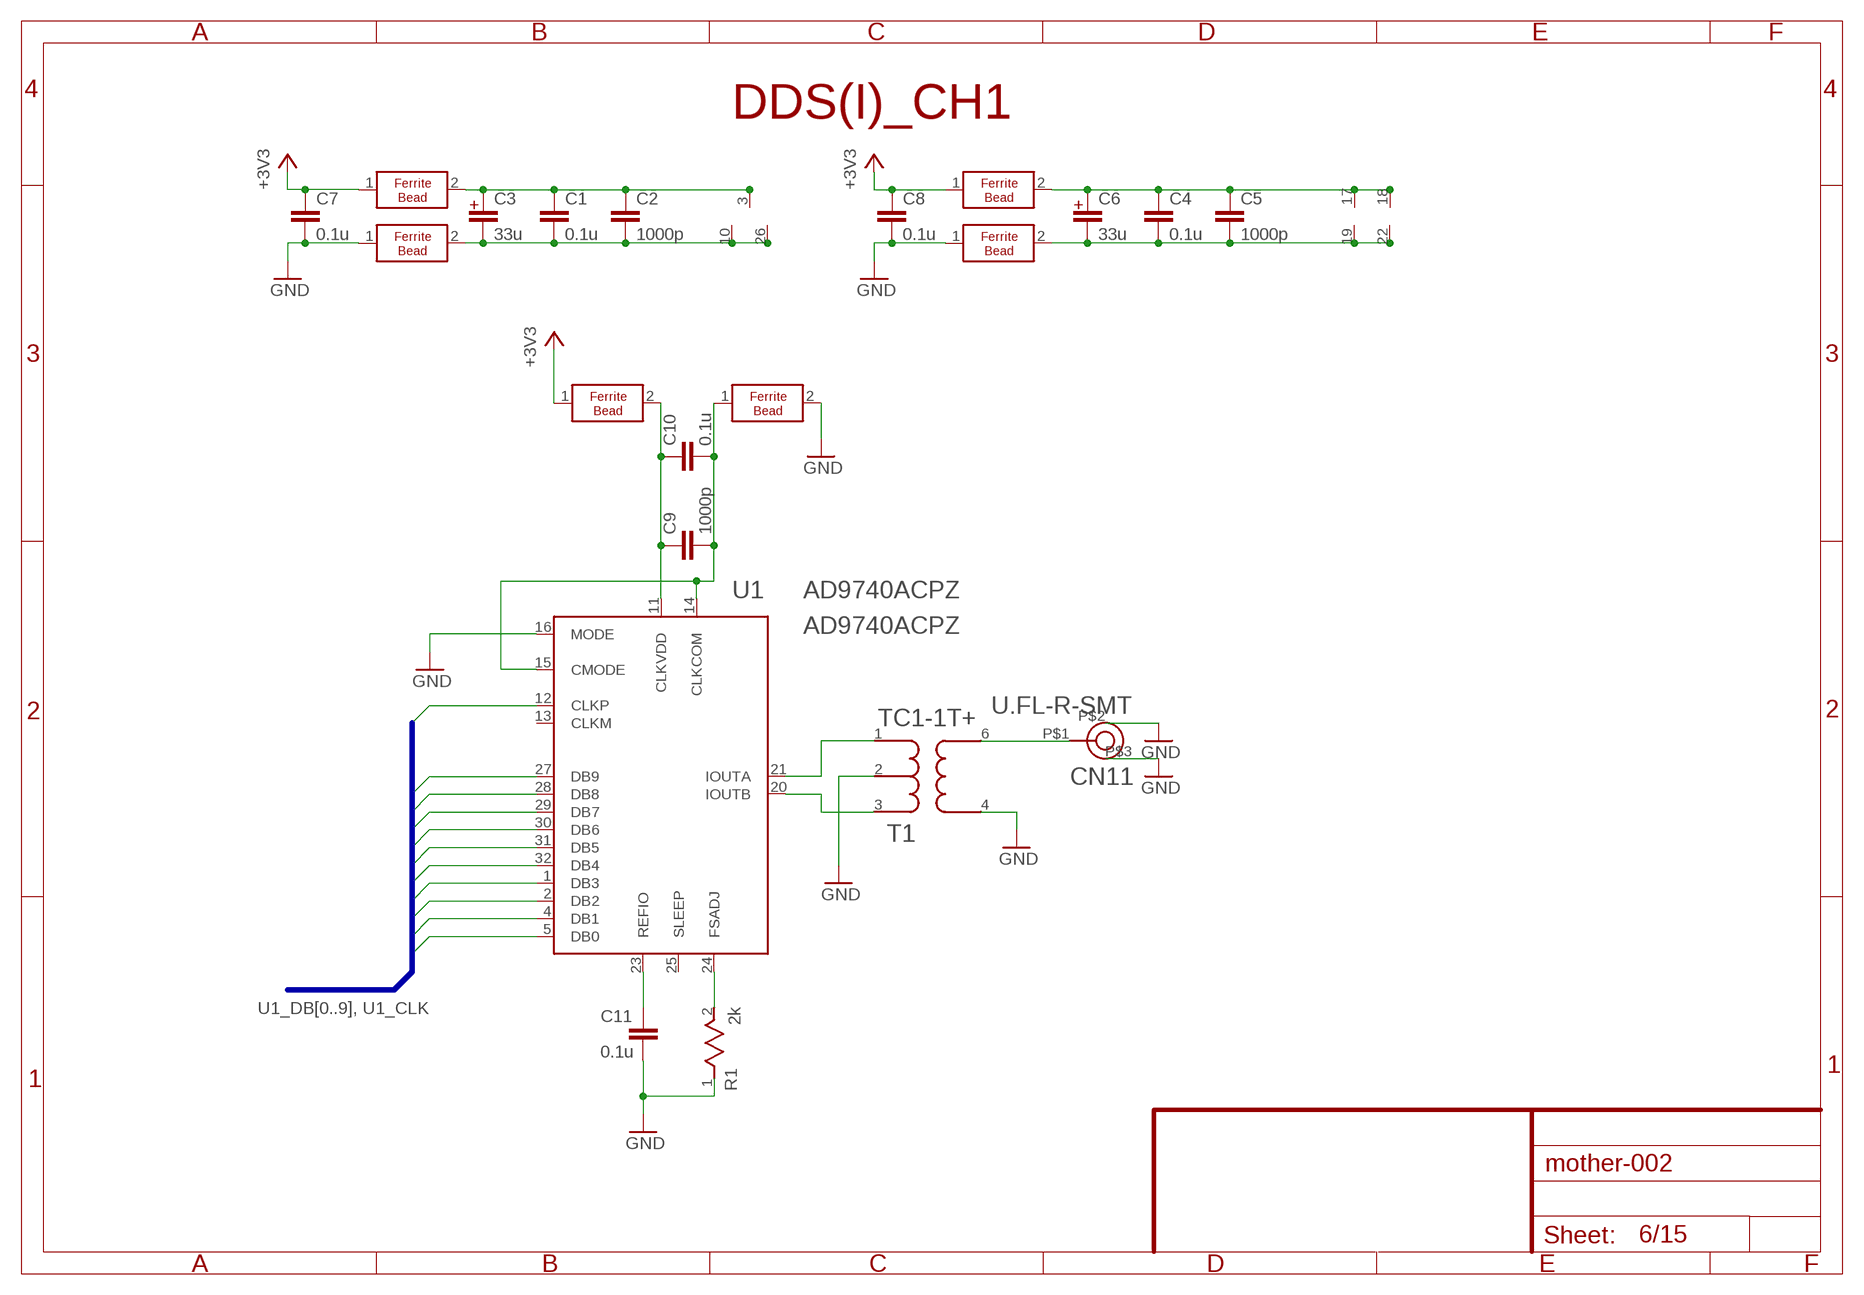
[diagram p5: schematic, sheet 6]

### Parts
C1  0.1u  C1005  [1005]
C2  1000p  C1005  [1005]
C3  33u  C_POLAR3216  [3216_POLAR]
C4  0.1u  C1005  [1005]
C5  1000p  C1005  [1005]
C6  33u  C_POLAR3216  [3216_POLAR]
C7  0.1u  C1005  [1005]
C8  0.1u  C1005  [1005]
C9  1000p  C1005  [1005]
C10  0.1u  C1005  [1005]
C11  0.1u  C1005  [1005]
CN11  U.FL-R-SMT  [U.FL-R-SMT]
FB1  FERRITEBEAD  [1608]
FB2  FERRITEBEAD  [1608]
FB3  FERRITEBEAD  [1608]
FB4  FERRITEBEAD  [1608]
FB5  FERRITEBEAD  [1608]
FB6  FERRITEBEAD  [1608]
R1  2k  R1005  [1005]
T1  TC1-1T+  [AT224]
U1  AD9740ACPZ  AD9740  [AD9740ACP]

### Nets
A0_U1: C4.2 C5.2 C6.2 FB4.2 U1.19(AGND) U1.22(AGND)
A33_U1: C4.1 C5.1 C6.1 FB3.2 U1.17(AVDD) U1.18(AVDD)
AGND: C8.2 C11.2 CN11.P$2(AGND) CN11.P$3(AGND2) FB4.1 R1.1 T1.2 T1.4 ; supply symbol labelled GND ; also sheet 1,3,7,8,9,10,11,13,14
AVDD: C8.1 FB3.1 ; supply symbol labelled +3V3 ; also sheet 3,7,8,9,10,11,13,14
CLKGND_U1: C9.2 C10.2 FB6.1 U1.14(CLKCOM) U1.15(CMODE)
CLKVDD_U1: C9.1 C10.1 FB5.2 U1.11(CLKVDD)
D0_U1: C1.2 C2.2 C3.2 FB2.2 U1.10(DGND) U1.16(MODE) U1.26(DGND) ; supply symbol labelled GND
D33_U1: C1.1 C2.1 C3.1 FB1.2 U1.3(DVDD)
DGND: C7.2 FB2.1 FB6.2 ; supply symbol labelled GND ; also sheet 1,2,3,4,5,7,8,9,10,11,12,13,14
DVDD: C7.1 FB1.1 FB5.1 ; supply symbol labelled +3V3 ; also sheet 1,2,3,4,7,8,9,10,11,13,14
N$1: C11.1 U1.23(REFIO)
N$4: R1.2 U1.24(FSADJ)
N$6: T1.1 U1.21(IOUTA)
N$9: T1.3 U1.20(IOUTB)
N$11: CN11.P$1 T1.6
U1_CLK: U1.12(CLKP) ; also sheet 2
U1_DB0: U1.5(DB0) ; also sheet 2
U1_DB1: U1.4(DB1) ; also sheet 2
U1_DB2: U1.2(DB2) ; also sheet 2
U1_DB3: U1.1(DB3) ; also sheet 2
U1_DB4: U1.32(DB4) ; also sheet 2
U1_DB5: U1.31(DB5) ; also sheet 2
U1_DB6: U1.30(DB6) ; also sheet 2
U1_DB7: U1.29(DB7) ; also sheet 2
U1_DB8: U1.28(DB8) ; also sheet 2
U1_DB9: U1.27(DB9) ; also sheet 2
Unconnected: U1.13(CLKM) U1.25(SLEEP)

### Buses
BUS1:U1_DB[0..9],U1_CLK

### Notes on the sheet
- DDS(I)_CH1
- AD9740ACPZ
- U1_DB[0..9], U1_CLK

## Sheet 7 of 15
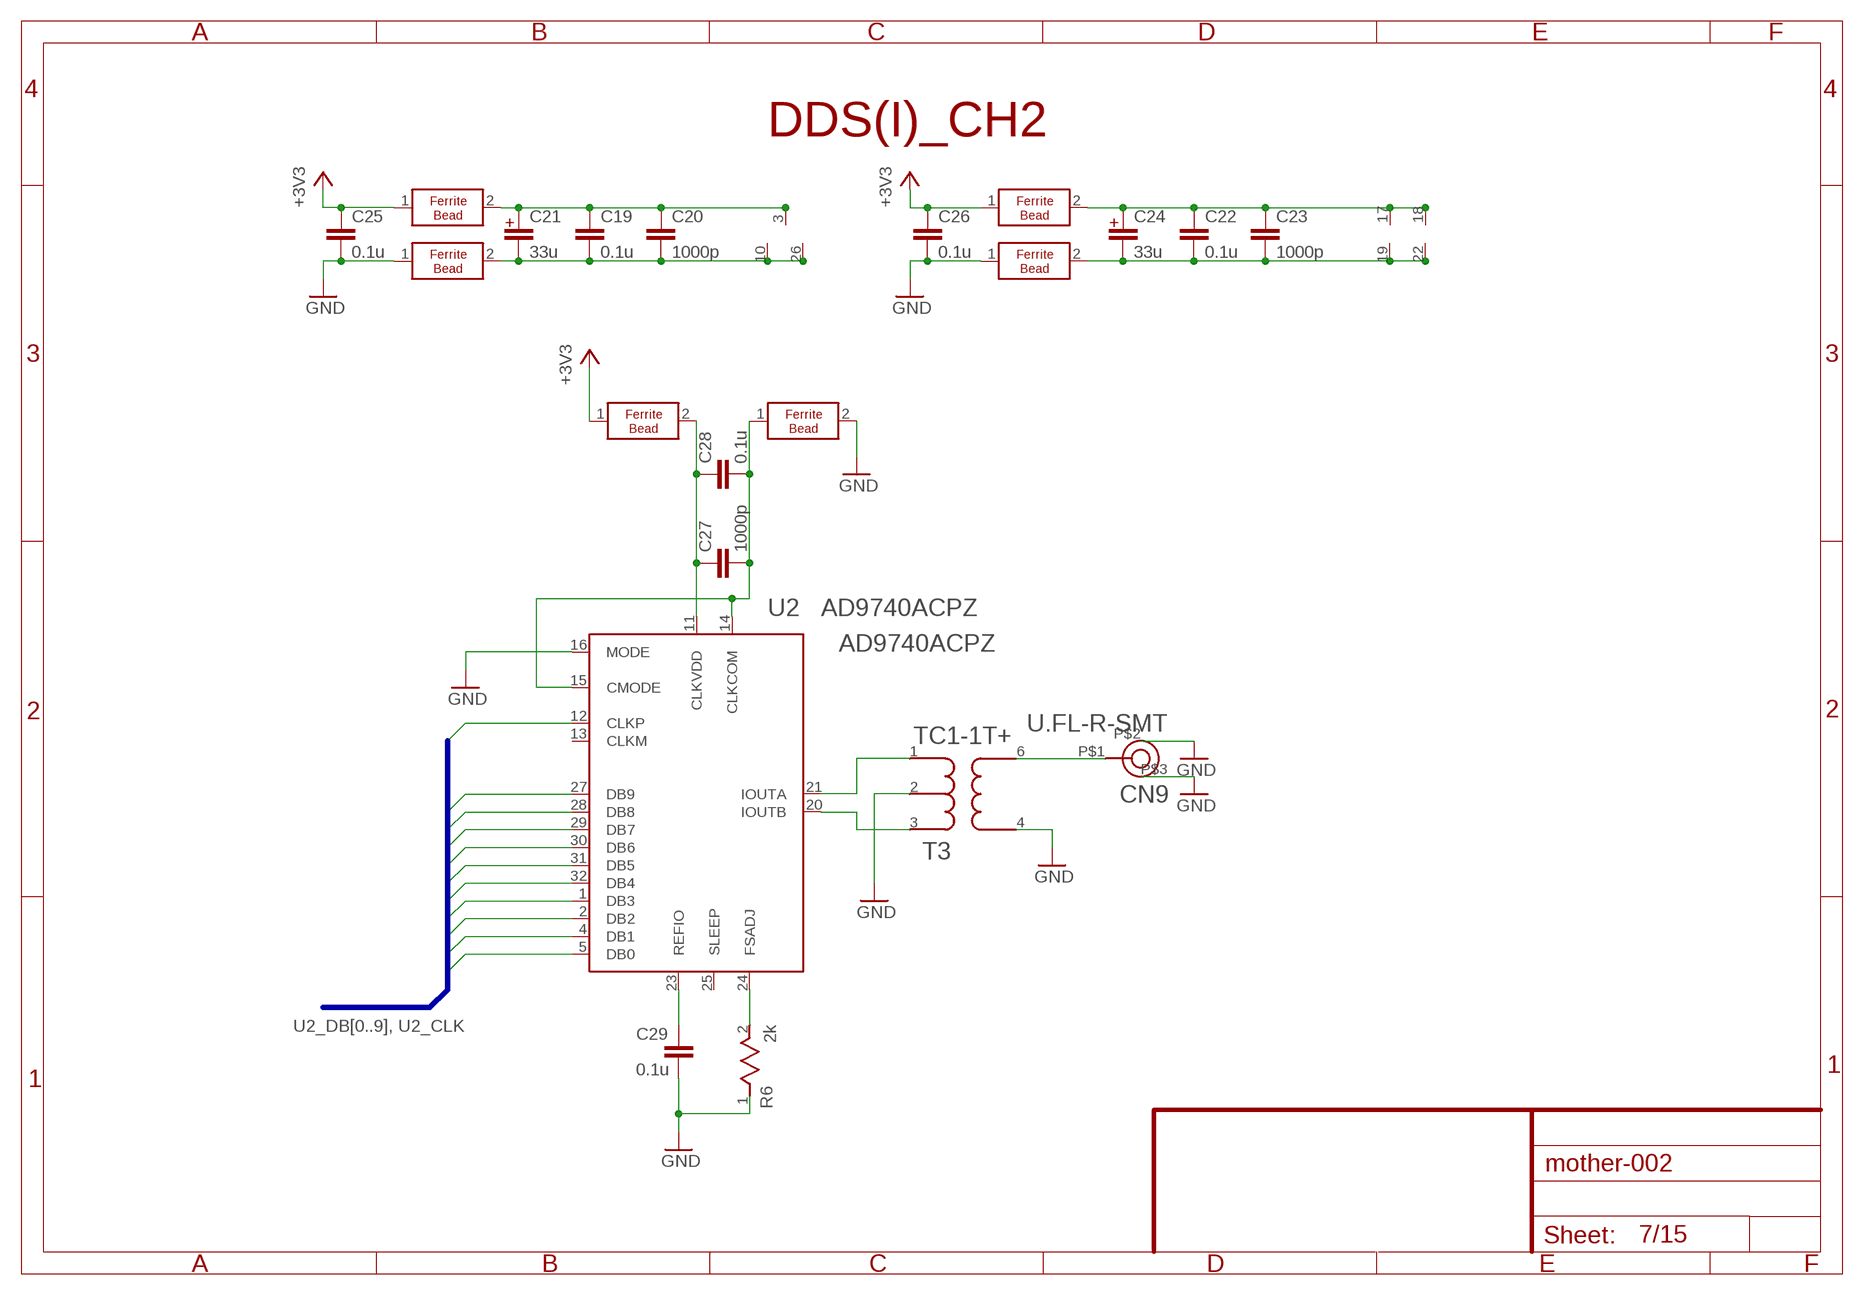
[diagram p6: schematic, sheet 7]

### Parts
C19  0.1u  C1005  [1005]
C20  1000p  C1005  [1005]
C21  33u  C_POLAR3216  [3216_POLAR]
C22  0.1u  C1005  [1005]
C23  1000p  C1005  [1005]
C24  33u  C_POLAR3216  [3216_POLAR]
C25  0.1u  C1005  [1005]
C26  0.1u  C1005  [1005]
C27  1000p  C1005  [1005]
C28  0.1u  C1005  [1005]
C29  0.1u  C1005  [1005]
CN9  U.FL-R-SMT  [U.FL-R-SMT]
FB7  FERRITEBEAD  [1608]
FB8  FERRITEBEAD  [1608]
FB9  FERRITEBEAD  [1608]
FB10  FERRITEBEAD  [1608]
FB11  FERRITEBEAD  [1608]
FB12  FERRITEBEAD  [1608]
R6  2k  R1005  [1005]
T3  TC1-1T+  [AT224]
U2  AD9740ACPZ  AD9740  [AD9740ACP]

### Nets
A0_U2: C22.2 C23.2 C24.2 FB10.2 U2.19(AGND) U2.22(AGND)
A33_U2: C22.1 C23.1 C24.1 FB9.2 U2.17(AVDD) U2.18(AVDD)
AGND: C26.2 C29.2 CN9.P$2(AGND) CN9.P$3(AGND2) FB10.1 R6.1 T3.2 T3.4 ; supply symbol labelled GND ; also sheet 1,3,6,8,9,10,11,13,14
AVDD: C26.1 FB9.1 ; supply symbol labelled +3V3 ; also sheet 3,6,8,9,10,11,13,14
CLKGND_U2: C27.2 C28.2 FB12.1 U2.14(CLKCOM) U2.15(CMODE)
CLKVDD_U2: C27.1 C28.1 FB11.2 U2.11(CLKVDD)
D0_U2: C19.2 C20.2 C21.2 FB8.2 U2.10(DGND) U2.16(MODE) U2.26(DGND) ; supply symbol labelled GND
D33_U2: C19.1 C20.1 C21.1 FB7.2 U2.3(DVDD)
DGND: C25.2 FB8.1 FB12.2 ; supply symbol labelled GND ; also sheet 1,2,3,4,5,6,8,9,10,11,12,13,14
DVDD: C25.1 FB7.1 FB11.1 ; supply symbol labelled +3V3 ; also sheet 1,2,3,4,6,8,9,10,11,13,14
N$18: C29.1 U2.23(REFIO)
N$19: R6.2 U2.24(FSADJ)
N$20: T3.1 U2.21(IOUTA)
N$21: T3.3 U2.20(IOUTB)
N$22: CN9.P$1 T3.6
U2_CLK: U2.12(CLKP) ; also sheet 2
U2_DB0: U2.5(DB0) ; also sheet 2
U2_DB1: U2.4(DB1) ; also sheet 2
U2_DB2: U2.2(DB2) ; also sheet 2
U2_DB3: U2.1(DB3) ; also sheet 2
U2_DB4: U2.32(DB4) ; also sheet 2
U2_DB5: U2.31(DB5) ; also sheet 2
U2_DB6: U2.30(DB6) ; also sheet 2
U2_DB7: U2.29(DB7) ; also sheet 2
U2_DB8: U2.28(DB8) ; also sheet 2
U2_DB9: U2.27(DB9) ; also sheet 2
Unconnected: U2.13(CLKM) U2.25(SLEEP)

### Buses
U2_DB[0..9],U2_CLK

### Notes on the sheet
- DDS(I)_CH2
- AD9740ACPZ
- U2_DB[0..9], U2_CLK

## Sheet 8 of 15
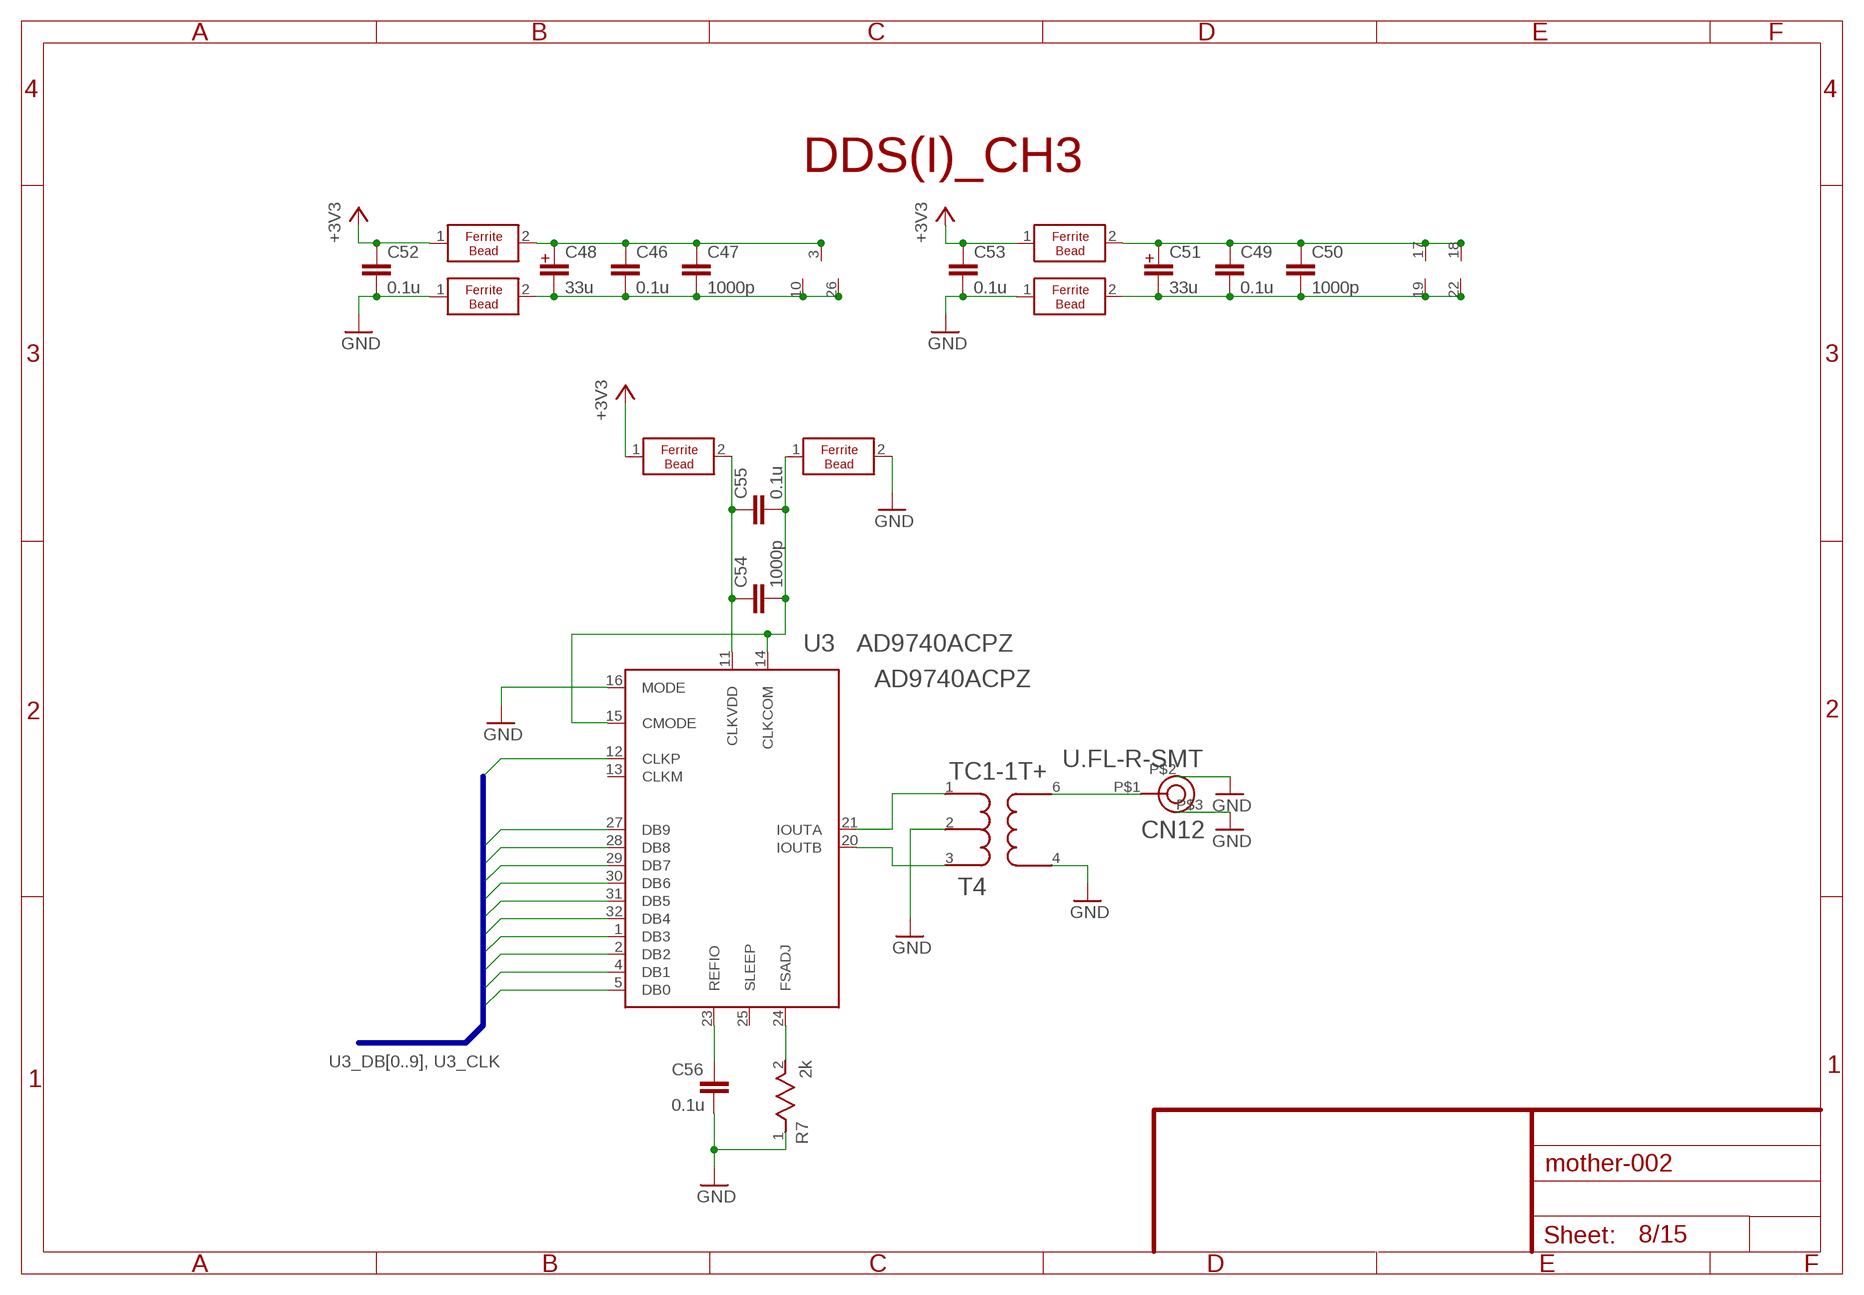
[diagram p7: schematic, sheet 8]

### Parts
C46  0.1u  C1005  [1005]
C47  1000p  C1005  [1005]
C48  33u  C_POLAR3216  [3216_POLAR]
C49  0.1u  C1005  [1005]
C50  1000p  C1005  [1005]
C51  33u  C_POLAR3216  [3216_POLAR]
C52  0.1u  C1005  [1005]
C53  0.1u  C1005  [1005]
C54  1000p  C1005  [1005]
C55  0.1u  C1005  [1005]
C56  0.1u  C1005  [1005]
CN12  U.FL-R-SMT  [U.FL-R-SMT]
FB13  FERRITEBEAD  [1608]
FB14  FERRITEBEAD  [1608]
FB15  FERRITEBEAD  [1608]
FB16  FERRITEBEAD  [1608]
FB17  FERRITEBEAD  [1608]
FB18  FERRITEBEAD  [1608]
R7  2k  R1005  [1005]
T4  TC1-1T+  [AT224]
U3  AD9740ACPZ  AD9740  [AD9740ACP]

### Nets
A0_U3: C49.2 C50.2 C51.2 FB16.2 U3.19(AGND) U3.22(AGND)
A33_U3: C49.1 C50.1 C51.1 FB15.2 U3.17(AVDD) U3.18(AVDD)
AGND: C53.2 C56.2 CN12.P$2(AGND) CN12.P$3(AGND2) FB16.1 R7.1 T4.2 T4.4 ; supply symbol labelled GND ; also sheet 1,3,6,7,9,10,11,13,14
AVDD: C53.1 FB15.1 ; supply symbol labelled +3V3 ; also sheet 3,6,7,9,10,11,13,14
CLKGND_U3: C54.2 C55.2 FB18.1 U3.14(CLKCOM) U3.15(CMODE)
CLKVDD_U3: C54.1 C55.1 FB17.2 U3.11(CLKVDD)
D0_U3: C46.2 C47.2 C48.2 FB14.2 U3.10(DGND) U3.16(MODE) U3.26(DGND) ; supply symbol labelled GND
D33_U3: C46.1 C47.1 C48.1 FB13.2 U3.3(DVDD)
DGND: C52.2 FB14.1 FB18.2 ; supply symbol labelled GND ; also sheet 1,2,3,4,5,6,7,9,10,11,12,13,14
DVDD: C52.1 FB13.1 FB17.1 ; supply symbol labelled +3V3 ; also sheet 1,2,3,4,6,7,9,10,11,13,14
N$23: C56.1 U3.23(REFIO)
N$24: R7.2 U3.24(FSADJ)
N$25: T4.1 U3.21(IOUTA)
N$26: T4.3 U3.20(IOUTB)
N$27: CN12.P$1 T4.6
U3_CLK: U3.12(CLKP) ; also sheet 4
U3_DB0: U3.5(DB0) ; also sheet 4
U3_DB1: U3.4(DB1) ; also sheet 4
U3_DB2: U3.2(DB2) ; also sheet 4
U3_DB3: U3.1(DB3) ; also sheet 4
U3_DB4: U3.32(DB4) ; also sheet 4
U3_DB5: U3.31(DB5) ; also sheet 4
U3_DB6: U3.30(DB6) ; also sheet 4
U3_DB7: U3.29(DB7) ; also sheet 4
U3_DB8: U3.28(DB8) ; also sheet 4
U3_DB9: U3.27(DB9) ; also sheet 4
Unconnected: U3.13(CLKM) U3.25(SLEEP)

### Buses
U3_DB[0..9],U3_CLK

### Notes on the sheet
- DDS(I)_CH3
- AD9740ACPZ
- U3_DB[0..9], U3_CLK

## Sheet 9 of 15
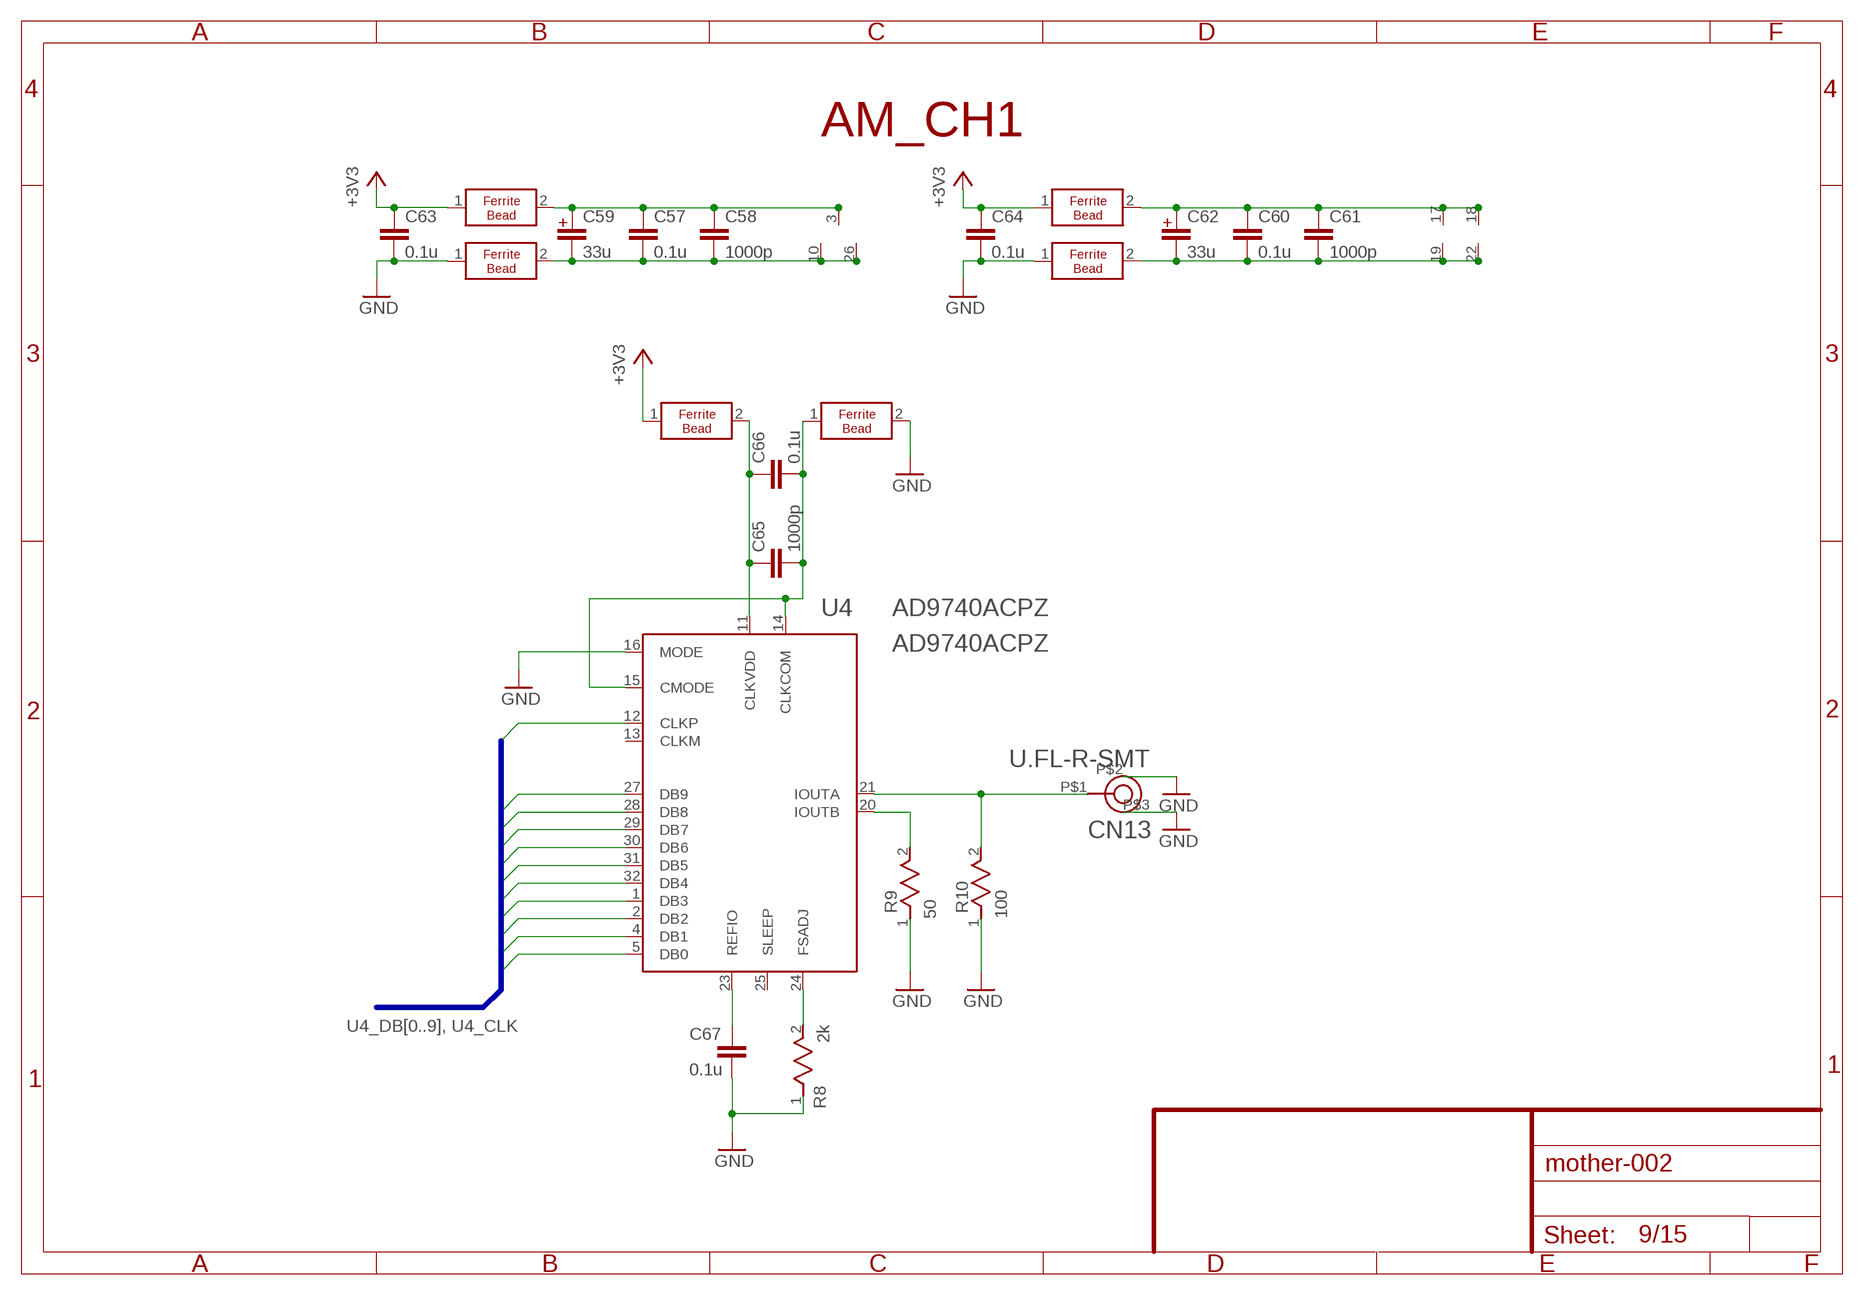
[diagram p8: schematic, sheet 9]

### Parts
C57  0.1u  C1005  [1005]
C58  1000p  C1005  [1005]
C59  33u  C_POLAR3216  [3216_POLAR]
C60  0.1u  C1005  [1005]
C61  1000p  C1005  [1005]
C62  33u  C_POLAR3216  [3216_POLAR]
C63  0.1u  C1005  [1005]
C64  0.1u  C1005  [1005]
C65  1000p  C1005  [1005]
C66  0.1u  C1005  [1005]
C67  0.1u  C1005  [1005]
CN13  U.FL-R-SMT  [U.FL-R-SMT]
FB19  FERRITEBEAD  [1608]
FB20  FERRITEBEAD  [1608]
FB21  FERRITEBEAD  [1608]
FB22  FERRITEBEAD  [1608]
FB23  FERRITEBEAD  [1608]
FB24  FERRITEBEAD  [1608]
R8  2k  R1005  [1005]
R9  50  R1005  [1005]
R10  100  R1005  [1005]
U4  AD9740ACPZ  AD9740  [AD9740ACP]

### Nets
A0_U4: C60.2 C61.2 C62.2 FB22.2 U4.19(AGND) U4.22(AGND)
A33_U4: C60.1 C61.1 C62.1 FB21.2 U4.17(AVDD) U4.18(AVDD)
AGND: C64.2 C67.2 CN13.P$2(AGND) CN13.P$3(AGND2) FB22.1 R8.1 R9.1 R10.1 ; supply symbol labelled GND ; also sheet 1,3,6,7,8,10,11,13,14
AVDD: C64.1 FB21.1 ; supply symbol labelled +3V3 ; also sheet 3,6,7,8,10,11,13,14
CLKGND_U4: C65.2 C66.2 FB24.1 U4.14(CLKCOM) U4.15(CMODE)
CLKVDD_U4: C65.1 C66.1 FB23.2 U4.11(CLKVDD)
D0_U4: C57.2 C58.2 C59.2 FB20.2 U4.10(DGND) U4.16(MODE) U4.26(DGND) ; supply symbol labelled GND
D33_U4: C57.1 C58.1 C59.1 FB19.2 U4.3(DVDD)
DGND: C63.2 FB20.1 FB24.2 ; supply symbol labelled GND ; also sheet 1,2,3,4,5,6,7,8,10,11,12,13,14
DVDD: C63.1 FB19.1 FB23.1 ; supply symbol labelled +3V3 ; also sheet 1,2,3,4,6,7,8,10,11,13,14
N$28: C67.1 U4.23(REFIO)
N$29: R8.2 U4.24(FSADJ)
N$31: R9.2 U4.20(IOUTB)
N$32: CN13.P$1 R10.2 U4.21(IOUTA)
U4_CLK: U4.12(CLKP) ; also sheet 3
U4_DB0: U4.5(DB0) ; also sheet 3
U4_DB1: U4.4(DB1) ; also sheet 3
U4_DB2: U4.2(DB2) ; also sheet 3
U4_DB3: U4.1(DB3) ; also sheet 3
U4_DB4: U4.32(DB4) ; also sheet 3
U4_DB5: U4.31(DB5) ; also sheet 3
U4_DB6: U4.30(DB6) ; also sheet 3
U4_DB7: U4.29(DB7) ; also sheet 3
U4_DB8: U4.28(DB8) ; also sheet 3
U4_DB9: U4.27(DB9) ; also sheet 3
Unconnected: U4.13(CLKM) U4.25(SLEEP)

### Buses
U4_DB[0..9],U4_CLK

### Notes on the sheet
- AM_CH1
- AD9740ACPZ
- U4_DB[0..9], U4_CLK

## Sheet 10 of 15
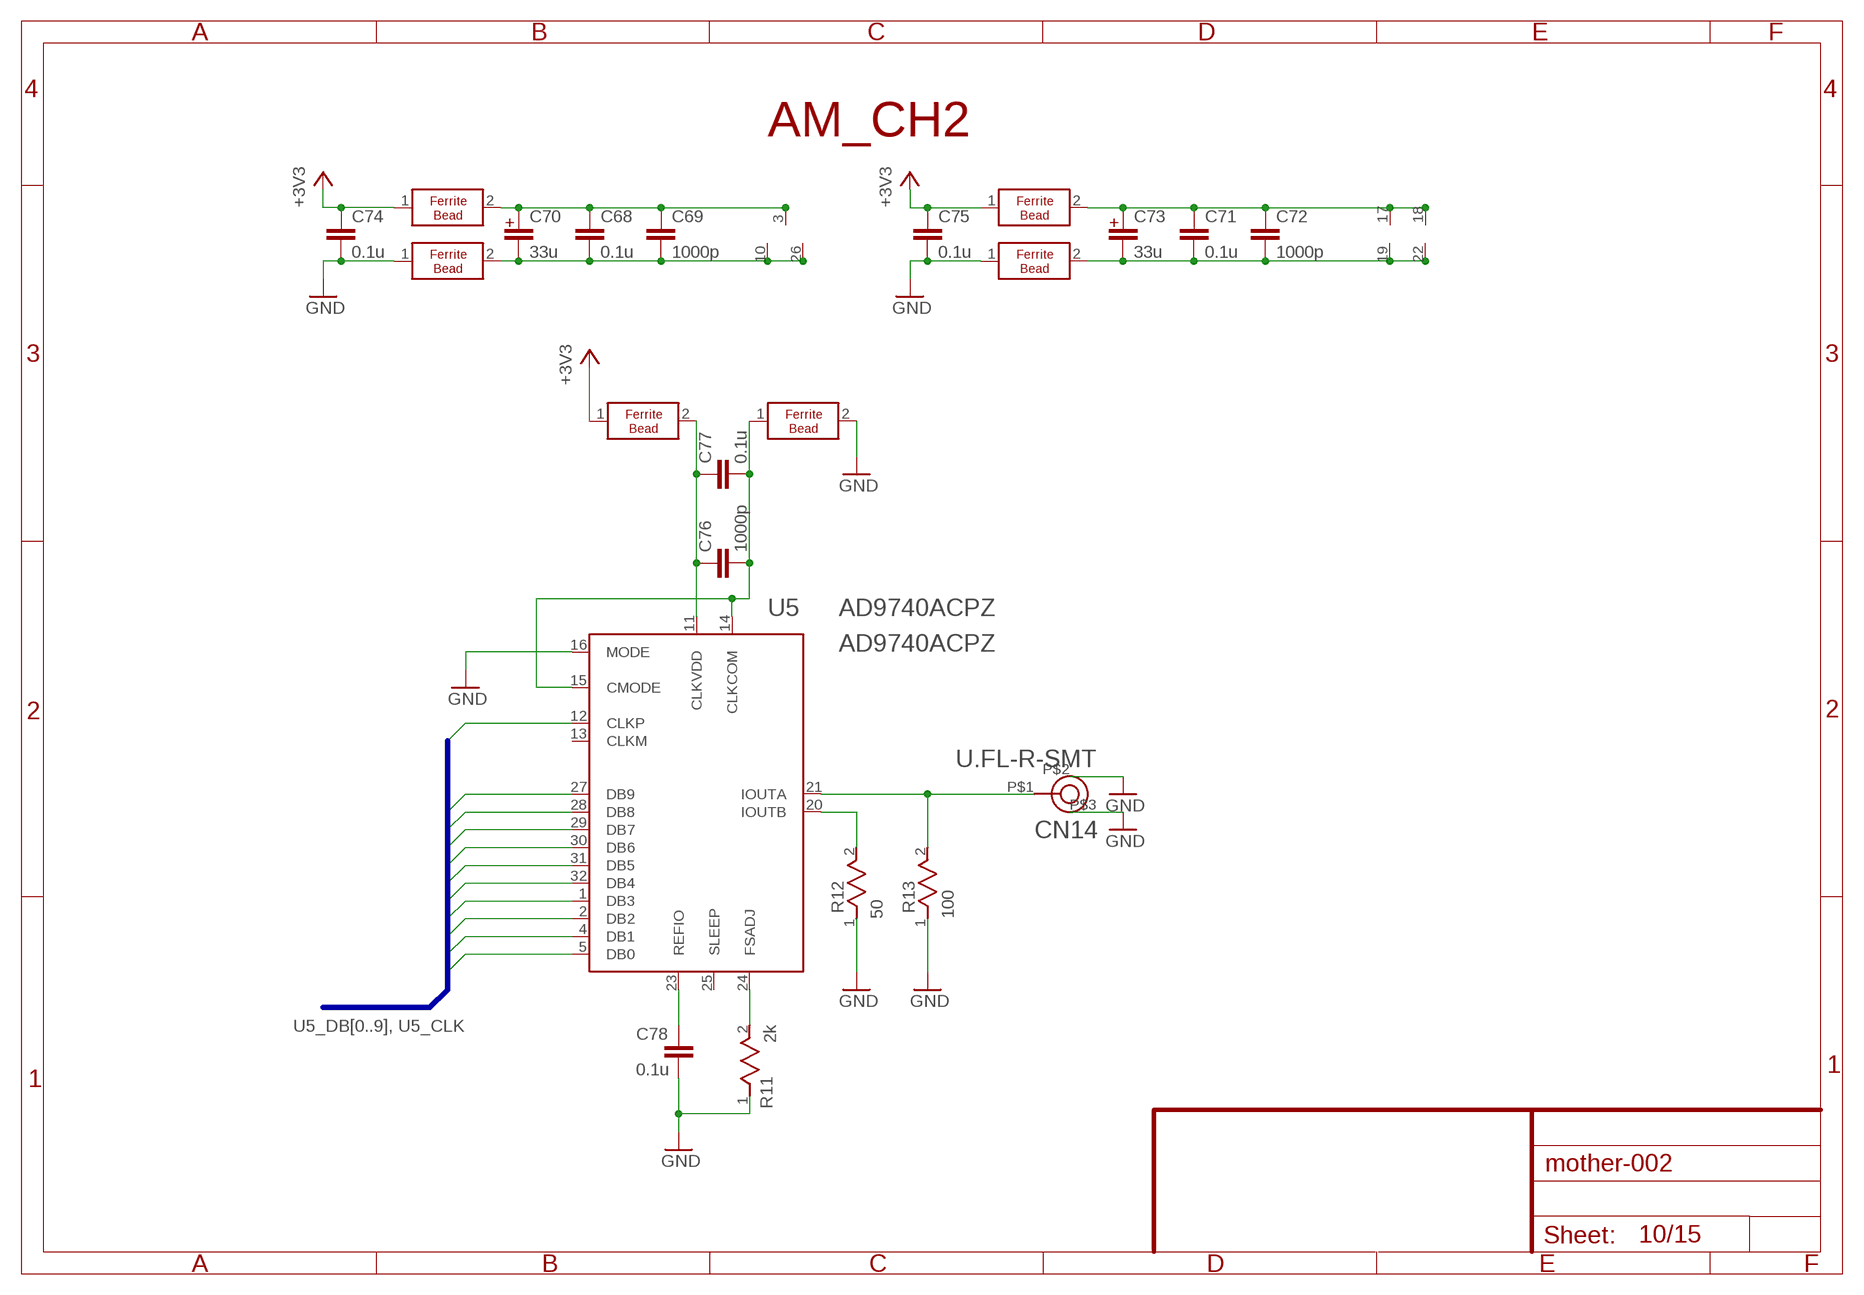
[diagram p9: schematic, sheet 10]

### Parts
C68  0.1u  C1005  [1005]
C69  1000p  C1005  [1005]
C70  33u  C_POLAR3216  [3216_POLAR]
C71  0.1u  C1005  [1005]
C72  1000p  C1005  [1005]
C73  33u  C_POLAR3216  [3216_POLAR]
C74  0.1u  C1005  [1005]
C75  0.1u  C1005  [1005]
C76  1000p  C1005  [1005]
C77  0.1u  C1005  [1005]
C78  0.1u  C1005  [1005]
CN14  U.FL-R-SMT  [U.FL-R-SMT]
FB25  FERRITEBEAD  [1608]
FB26  FERRITEBEAD  [1608]
FB27  FERRITEBEAD  [1608]
FB28  FERRITEBEAD  [1608]
FB29  FERRITEBEAD  [1608]
FB30  FERRITEBEAD  [1608]
R11  2k  R1005  [1005]
R12  50  R1005  [1005]
R13  100  R1005  [1005]
U5  AD9740ACPZ  AD9740  [AD9740ACP]

### Nets
A0_U5: C71.2 C72.2 C73.2 FB28.2 U5.19(AGND) U5.22(AGND)
A33_U5: C71.1 C72.1 C73.1 FB27.2 U5.17(AVDD) U5.18(AVDD)
AGND: C75.2 C78.2 CN14.P$2(AGND) CN14.P$3(AGND2) FB28.1 R11.1 R12.1 R13.1 ; supply symbol labelled GND ; also sheet 1,3,6,7,8,9,11,13,14
AVDD: C75.1 FB27.1 ; supply symbol labelled +3V3 ; also sheet 3,6,7,8,9,11,13,14
CLKGND_U5: C76.2 C77.2 FB30.1 U5.14(CLKCOM) U5.15(CMODE)
CLKVDD_U5: C76.1 C77.1 FB29.2 U5.11(CLKVDD)
D0_U5: C68.2 C69.2 C70.2 FB26.2 U5.10(DGND) U5.16(MODE) U5.26(DGND) ; supply symbol labelled GND
D33_U5: C68.1 C69.1 C70.1 FB25.2 U5.3(DVDD)
DGND: C74.2 FB26.1 FB30.2 ; supply symbol labelled GND ; also sheet 1,2,3,4,5,6,7,8,9,11,12,13,14
DVDD: C74.1 FB25.1 FB29.1 ; supply symbol labelled +3V3 ; also sheet 1,2,3,4,6,7,8,9,11,13,14
N$30: C78.1 U5.23(REFIO)
N$33: R11.2 U5.24(FSADJ)
N$34: R12.2 U5.20(IOUTB)
N$35: CN14.P$1 R13.2 U5.21(IOUTA)
U5_CLK: U5.12(CLKP) ; also sheet 3
U5_DB0: U5.5(DB0) ; also sheet 3
U5_DB1: U5.4(DB1) ; also sheet 3
U5_DB2: U5.2(DB2) ; also sheet 3
U5_DB3: U5.1(DB3) ; also sheet 3
U5_DB4: U5.32(DB4) ; also sheet 3
U5_DB5: U5.31(DB5) ; also sheet 3
U5_DB6: U5.30(DB6) ; also sheet 3
U5_DB7: U5.29(DB7) ; also sheet 3
U5_DB8: U5.28(DB8) ; also sheet 3
U5_DB9: U5.27(DB9) ; also sheet 3
Unconnected: U5.13(CLKM) U5.25(SLEEP)

### Buses
U5_DB[0..9],U5_CLK

### Notes on the sheet
- AM_CH2
- AD9740ACPZ
- U5_DB[0..9], U5_CLK

## Sheet 11 of 15
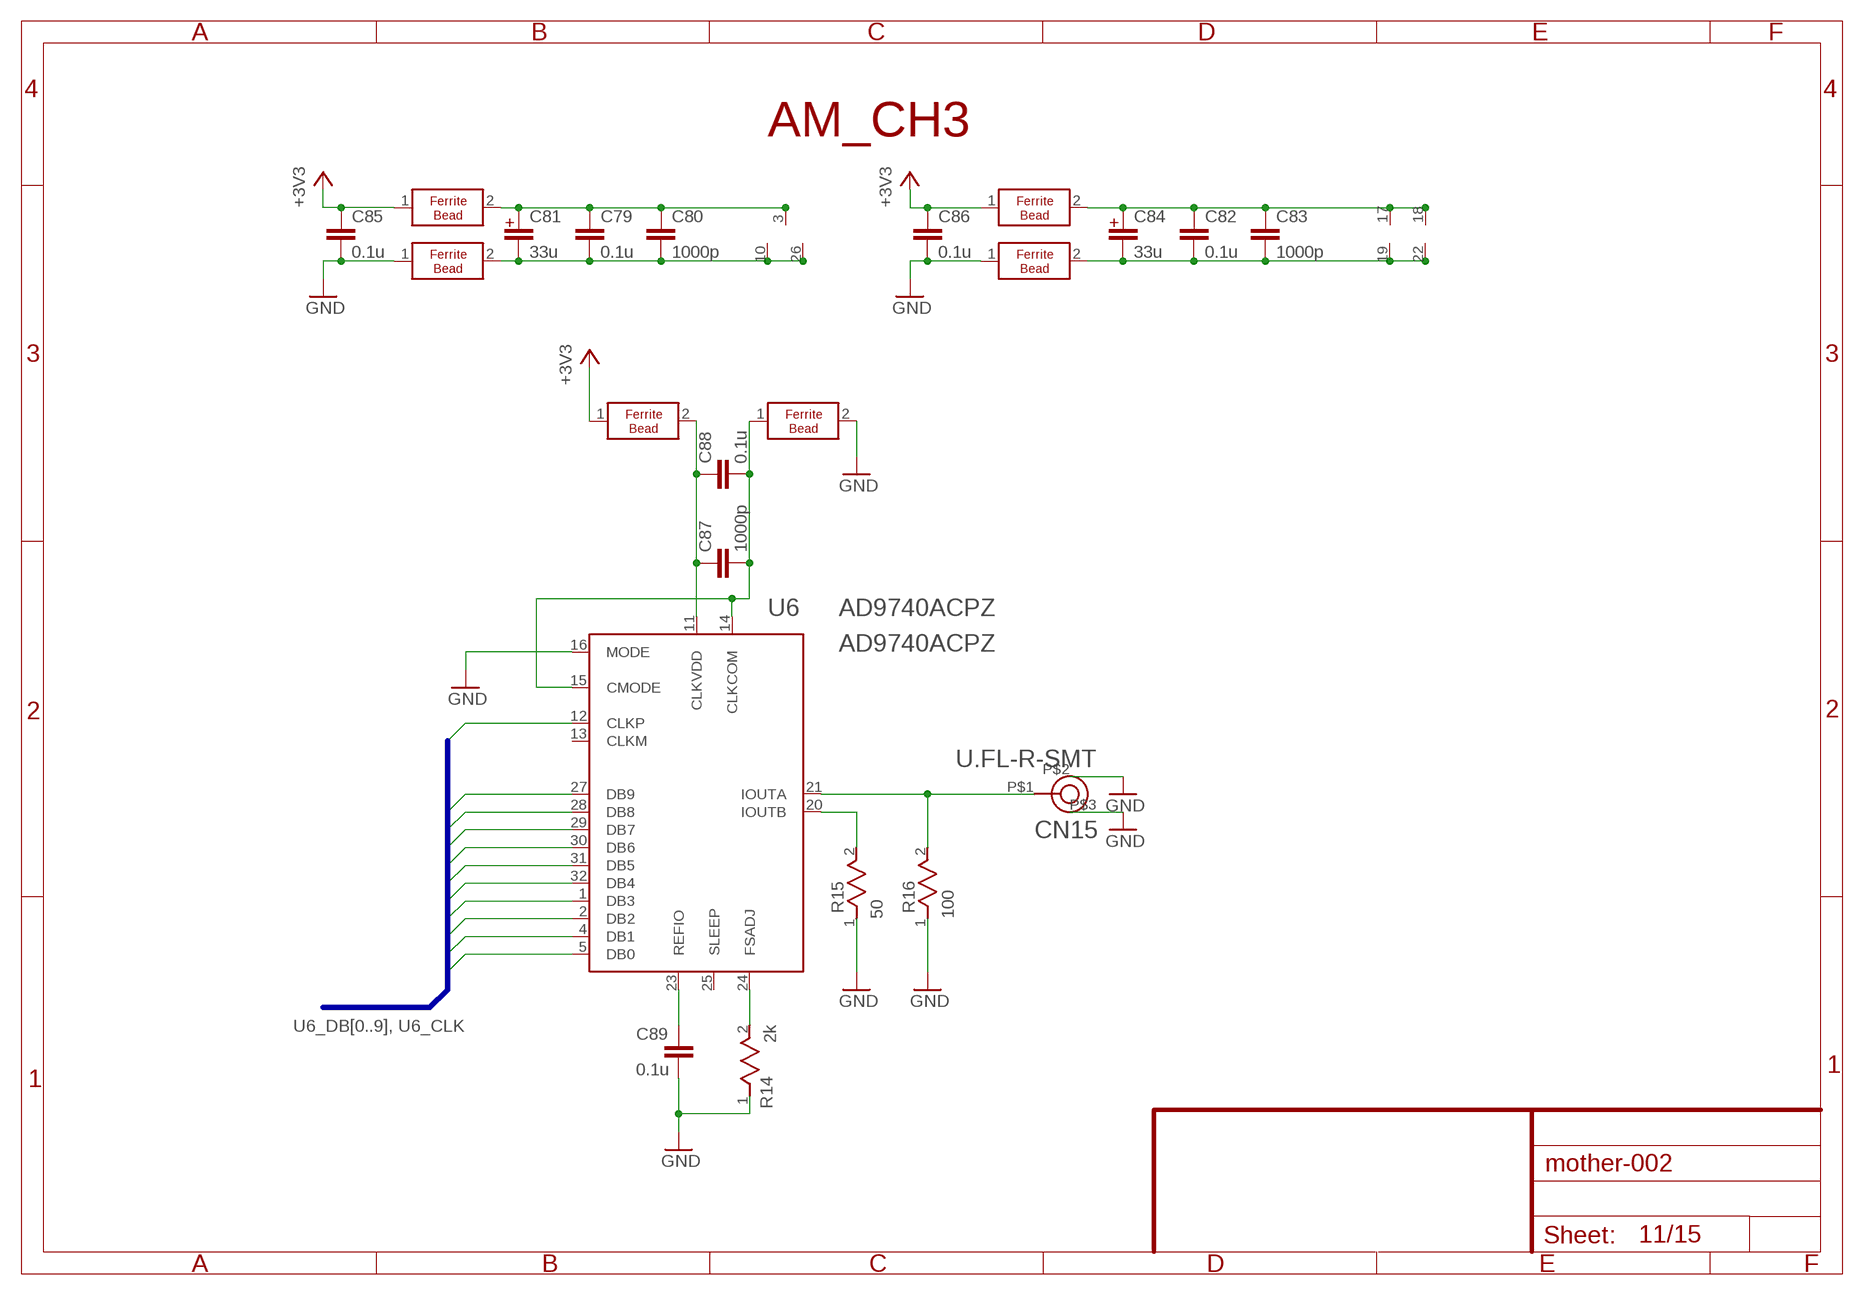
[diagram p10: schematic, sheet 11]

### Parts
C79  0.1u  C1005  [1005]
C80  1000p  C1005  [1005]
C81  33u  C_POLAR3216  [3216_POLAR]
C82  0.1u  C1005  [1005]
C83  1000p  C1005  [1005]
C84  33u  C_POLAR3216  [3216_POLAR]
C85  0.1u  C1005  [1005]
C86  0.1u  C1005  [1005]
C87  1000p  C1005  [1005]
C88  0.1u  C1005  [1005]
C89  0.1u  C1005  [1005]
CN15  U.FL-R-SMT  [U.FL-R-SMT]
FB31  FERRITEBEAD  [1608]
FB32  FERRITEBEAD  [1608]
FB33  FERRITEBEAD  [1608]
FB34  FERRITEBEAD  [1608]
FB35  FERRITEBEAD  [1608]
FB36  FERRITEBEAD  [1608]
R14  2k  R1005  [1005]
R15  50  R1005  [1005]
R16  100  R1005  [1005]
U6  AD9740ACPZ  AD9740  [AD9740ACP]

### Nets
A0_U6: C82.2 C83.2 C84.2 FB34.2 U6.19(AGND) U6.22(AGND)
A33_U6: C82.1 C83.1 C84.1 FB33.2 U6.17(AVDD) U6.18(AVDD)
AGND: C86.2 C89.2 CN15.P$2(AGND) CN15.P$3(AGND2) FB34.1 R14.1 R15.1 R16.1 ; supply symbol labelled GND ; also sheet 1,3,6,7,8,9,10,13,14
AVDD: C86.1 FB33.1 ; supply symbol labelled +3V3 ; also sheet 3,6,7,8,9,10,13,14
CLKGND_U6: C87.2 C88.2 FB36.1 U6.14(CLKCOM) U6.15(CMODE)
CLKVDD_U6: C87.1 C88.1 FB35.2 U6.11(CLKVDD)
D0_U6: C79.2 C80.2 C81.2 FB32.2 U6.10(DGND) U6.16(MODE) U6.26(DGND) ; supply symbol labelled GND
D33_U6: C79.1 C80.1 C81.1 FB31.2 U6.3(DVDD)
DGND: C85.2 FB32.1 FB36.2 ; supply symbol labelled GND ; also sheet 1,2,3,4,5,6,7,8,9,10,12,13,14
DVDD: C85.1 FB31.1 FB35.1 ; supply symbol labelled +3V3 ; also sheet 1,2,3,4,6,7,8,9,10,13,14
N$36: C89.1 U6.23(REFIO)
N$37: R14.2 U6.24(FSADJ)
N$38: R15.2 U6.20(IOUTB)
N$39: CN15.P$1 R16.2 U6.21(IOUTA)
U6_CLK: U6.12(CLKP) ; also sheet 3
U6_DB0: U6.5(DB0) ; also sheet 3
U6_DB1: U6.4(DB1) ; also sheet 3
U6_DB2: U6.2(DB2) ; also sheet 3
U6_DB3: U6.1(DB3) ; also sheet 3
U6_DB4: U6.32(DB4) ; also sheet 3
U6_DB5: U6.31(DB5) ; also sheet 3
U6_DB6: U6.30(DB6) ; also sheet 3
U6_DB7: U6.29(DB7) ; also sheet 3
U6_DB8: U6.28(DB8) ; also sheet 3
U6_DB9: U6.27(DB9) ; also sheet 3
Unconnected: U6.13(CLKM) U6.25(SLEEP)

### Buses
U6_DB[0..9],U6_CLK

### Notes on the sheet
- AM_CH3
- AD9740ACPZ
- U6_DB[0..9], U6_CLK

## Sheet 12 of 15
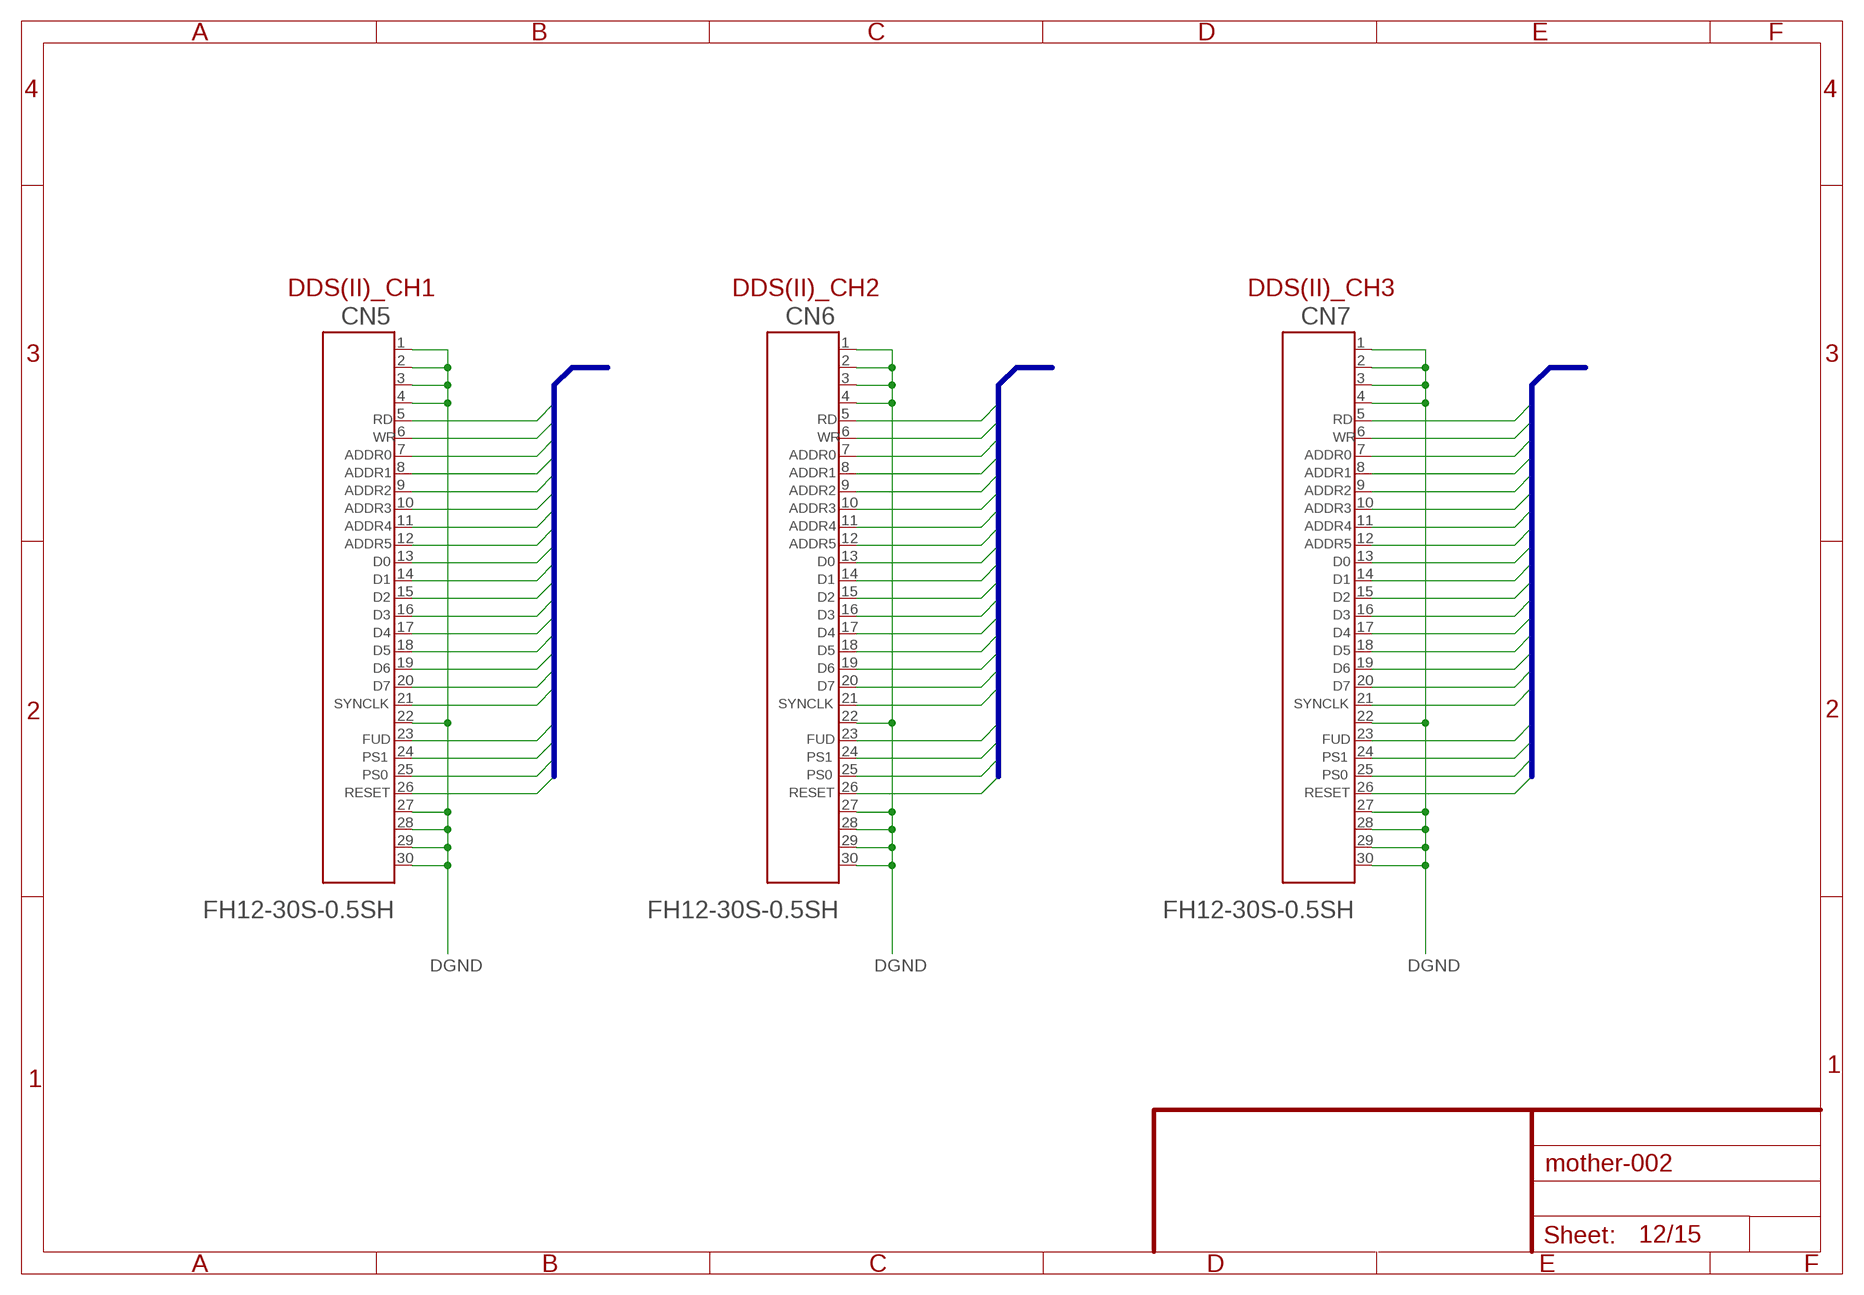
[diagram p11: schematic, sheet 12]

### Parts
CN5  FH12-30S-0.5SH  [FPC_30]
CN6  FH12-30S-0.5SH  [FPC_30]
CN7  FH12-30S-0.5SH  [FPC_30]

### Nets
DDS2CH1_ADDR0: CN5.7 ; also sheet 2
DDS2CH1_ADDR1: CN5.8 ; also sheet 2
DDS2CH1_ADDR2: CN5.9 ; also sheet 2
DDS2CH1_ADDR3: CN5.10 ; also sheet 2
DDS2CH1_ADDR4: CN5.11 ; also sheet 2
DDS2CH1_ADDR5: CN5.12 ; also sheet 2
DDS2CH1_D0: CN5.13 ; also sheet 2
DDS2CH1_D1: CN5.14 ; also sheet 2
DDS2CH1_D2: CN5.15 ; also sheet 2
DDS2CH1_D3: CN5.16 ; also sheet 2
DDS2CH1_D4: CN5.17 ; also sheet 2
DDS2CH1_D5: CN5.18 ; also sheet 2
DDS2CH1_D6: CN5.19 ; also sheet 2
DDS2CH1_D7: CN5.20 ; also sheet 2
DDS2CH1_FUD: CN5.23 ; also sheet 2
DDS2CH1_PS0: CN5.25 ; also sheet 2
DDS2CH1_PS1: CN5.24 ; also sheet 2
DDS2CH1_RD: CN5.5 ; also sheet 2
DDS2CH1_RST: CN5.26 ; also sheet 2
DDS2CH1_SYNCLK: CN5.21 ; also sheet 2
DDS2CH1_WR: CN5.6 ; also sheet 2
DDS2CH2_ADDR0: CN6.7 ; also sheet 2
DDS2CH2_ADDR1: CN6.8 ; also sheet 2
DDS2CH2_ADDR2: CN6.9 ; also sheet 2
DDS2CH2_ADDR3: CN6.10 ; also sheet 4
DDS2CH2_ADDR4: CN6.11 ; also sheet 4
DDS2CH2_ADDR5: CN6.12 ; also sheet 4
DDS2CH2_D0: CN6.13 ; also sheet 4
DDS2CH2_D1: CN6.14 ; also sheet 4
DDS2CH2_D2: CN6.15 ; also sheet 4
DDS2CH2_D3: CN6.16 ; also sheet 4
DDS2CH2_D4: CN6.17 ; also sheet 4
DDS2CH2_D5: CN6.18 ; also sheet 4
DDS2CH2_D6: CN6.19 ; also sheet 4
DDS2CH2_D7: CN6.20 ; also sheet 4
DDS2CH2_FUD: CN6.23 ; also sheet 4
DDS2CH2_PS0: CN6.25 ; also sheet 4
DDS2CH2_PS1: CN6.24 ; also sheet 4
DDS2CH2_RD: CN6.5 ; also sheet 2
DDS2CH2_RST: CN6.26 ; also sheet 4
DDS2CH2_SYNCLK: CN6.21 ; also sheet 4
DDS2CH2_WR: CN6.6 ; also sheet 2
DDS2CH3_ADDR0: CN7.7 ; also sheet 4
DDS2CH3_ADDR1: CN7.8 ; also sheet 4
DDS2CH3_ADDR2: CN7.9 ; also sheet 4
DDS2CH3_ADDR3: CN7.10 ; also sheet 4
DDS2CH3_ADDR4: CN7.11 ; also sheet 4
DDS2CH3_ADDR5: CN7.12 ; also sheet 4
DDS2CH3_D0: CN7.13 ; also sheet 4
DDS2CH3_D1: CN7.14 ; also sheet 4
DDS2CH3_D2: CN7.15 ; also sheet 4
DDS2CH3_D3: CN7.16 ; also sheet 4
DDS2CH3_D4: CN7.17 ; also sheet 4
DDS2CH3_D5: CN7.18 ; also sheet 4
DDS2CH3_D6: CN7.19 ; also sheet 4
DDS2CH3_D7: CN7.20 ; also sheet 4
DDS2CH3_FUD: CN7.23 ; also sheet 4
DDS2CH3_PS0: CN7.25 ; also sheet 4
DDS2CH3_PS1: CN7.24 ; also sheet 4
DDS2CH3_RD: CN7.5 ; also sheet 4
DDS2CH3_RST: CN7.26 ; also sheet 4
DDS2CH3_SYNCLK: CN7.21 ; also sheet 4
DDS2CH3_WR: CN7.6 ; also sheet 4
DGND: CN5.1 CN5.2 CN5.3 CN5.4 CN5.22 CN5.27 CN5.28 CN5.29 CN5.30 CN6.1 CN6.2 CN6.3 CN6.4 CN6.22 CN6.27 CN6.28 CN6.29 CN6.30 CN7.1 CN7.2 CN7.3 CN7.4 CN7.22 CN7.27 CN7.28 CN7.29 CN7.30 ; also sheet 1,2,3,4,5,6,7,8,9,10,11,13,14

### Buses
DDS2CH1_RST,DDS2CH1_PS[0..1],DDS2CH1_FUD,DDS2CH1_SYNCLK,DDS2CH1_D[0..7],DDS2CH1_ADDR[0..5],DDS2CH1_WR,DDS2CH1_RD
DDS2CH2_RST,DDS2CH2_PS[0..1],DDS2CH2_FUD,DDS2CH2_SYNCLK,DDS2CH2_D[0..7],DDS2CH2_ADDR[0..5],DDS2CH2_WR,DDS2CH2_RD
DDS2CH3_RST,DDS2CH3_PS[0..1],DDS2CH3_FUD,DDS2CH3_SYNCLK,DDS2CH3_D[0..7],DDS2CH3_ADDR[0..5],DDS2CH3_WR,DDS2CH3_RD

### Notes on the sheet
- DDS(II)_CH1 | DDS(II)_CH2 | DDS(II)_CH3
- RD | RD | RD
- WR | WR | WR
- ADDR0 | ADDR0 | ADDR0
- ADDR1 | ADDR1 | ADDR1
- ADDR2 | ADDR2 | ADDR2
- ADDR3 | ADDR3 | ADDR3
- ADDR4 | ADDR4 | ADDR4
- ADDR5 | ADDR5 | ADDR5
- D0 | D0 | D0
- D1 | D1 | D1
- D2 | D2 | D2
- D3 | D3 | D3
- D4 | D4 | D4
- D5 | D5 | D5
- D6 | D6 | D6
- D7 | D7 | D7
- SYNCLK | SYNCLK | SYNCLK
- FUD | FUD | FUD
- PS1 | PS1 | PS1
- PS0 | PS0 | PS0
- RESET | RESET | RESET
- DGND | DGND | DGND

## Sheet 13 of 15
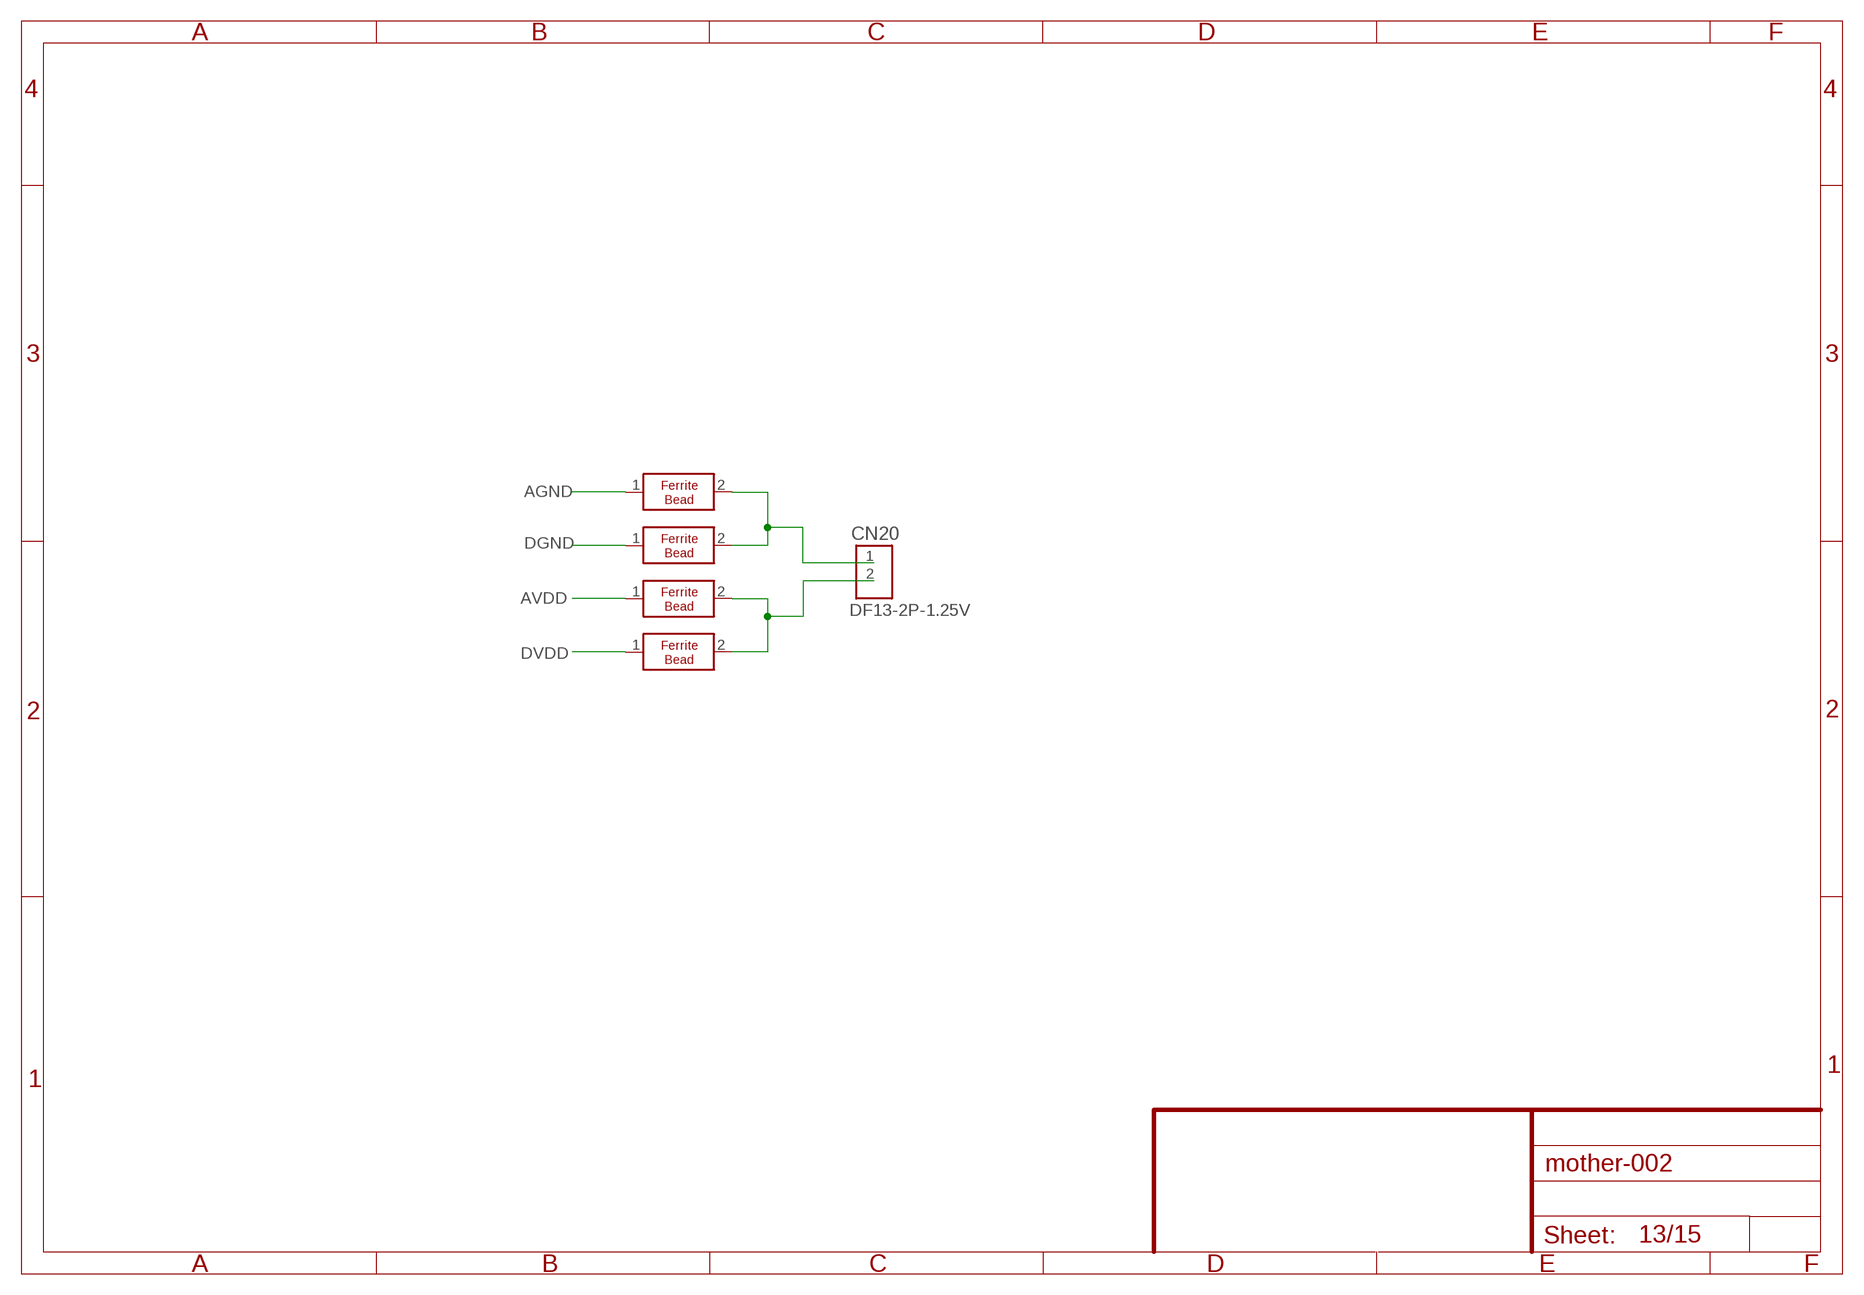
[diagram p12: schematic, sheet 13]

### Parts
CN20  DF13-2P-1.25V  [DF13-2P-12.5V]
FB37  FERRITEBEAD  [1608]
FB38  FERRITEBEAD  [1608]
FB39  FERRITEBEAD  [1608]
FB40  FERRITEBEAD  [1608]

### Nets
AGND: FB37.1 ; also sheet 1,3,6,7,8,9,10,11,14
AVDD: FB39.1 ; also sheet 3,6,7,8,9,10,11,14
DGND: FB38.1 ; also sheet 1,2,3,4,5,6,7,8,9,10,11,12,14
DVDD: FB40.1 ; also sheet 1,2,3,4,6,7,8,9,10,11,14
N$67: CN20.1 FB37.2 FB38.2
N$70: CN20.2 FB39.2 FB40.2

### Notes on the sheet
- AGND
- DGND
- AVDD
- DVDD

## Sheet 14 of 15
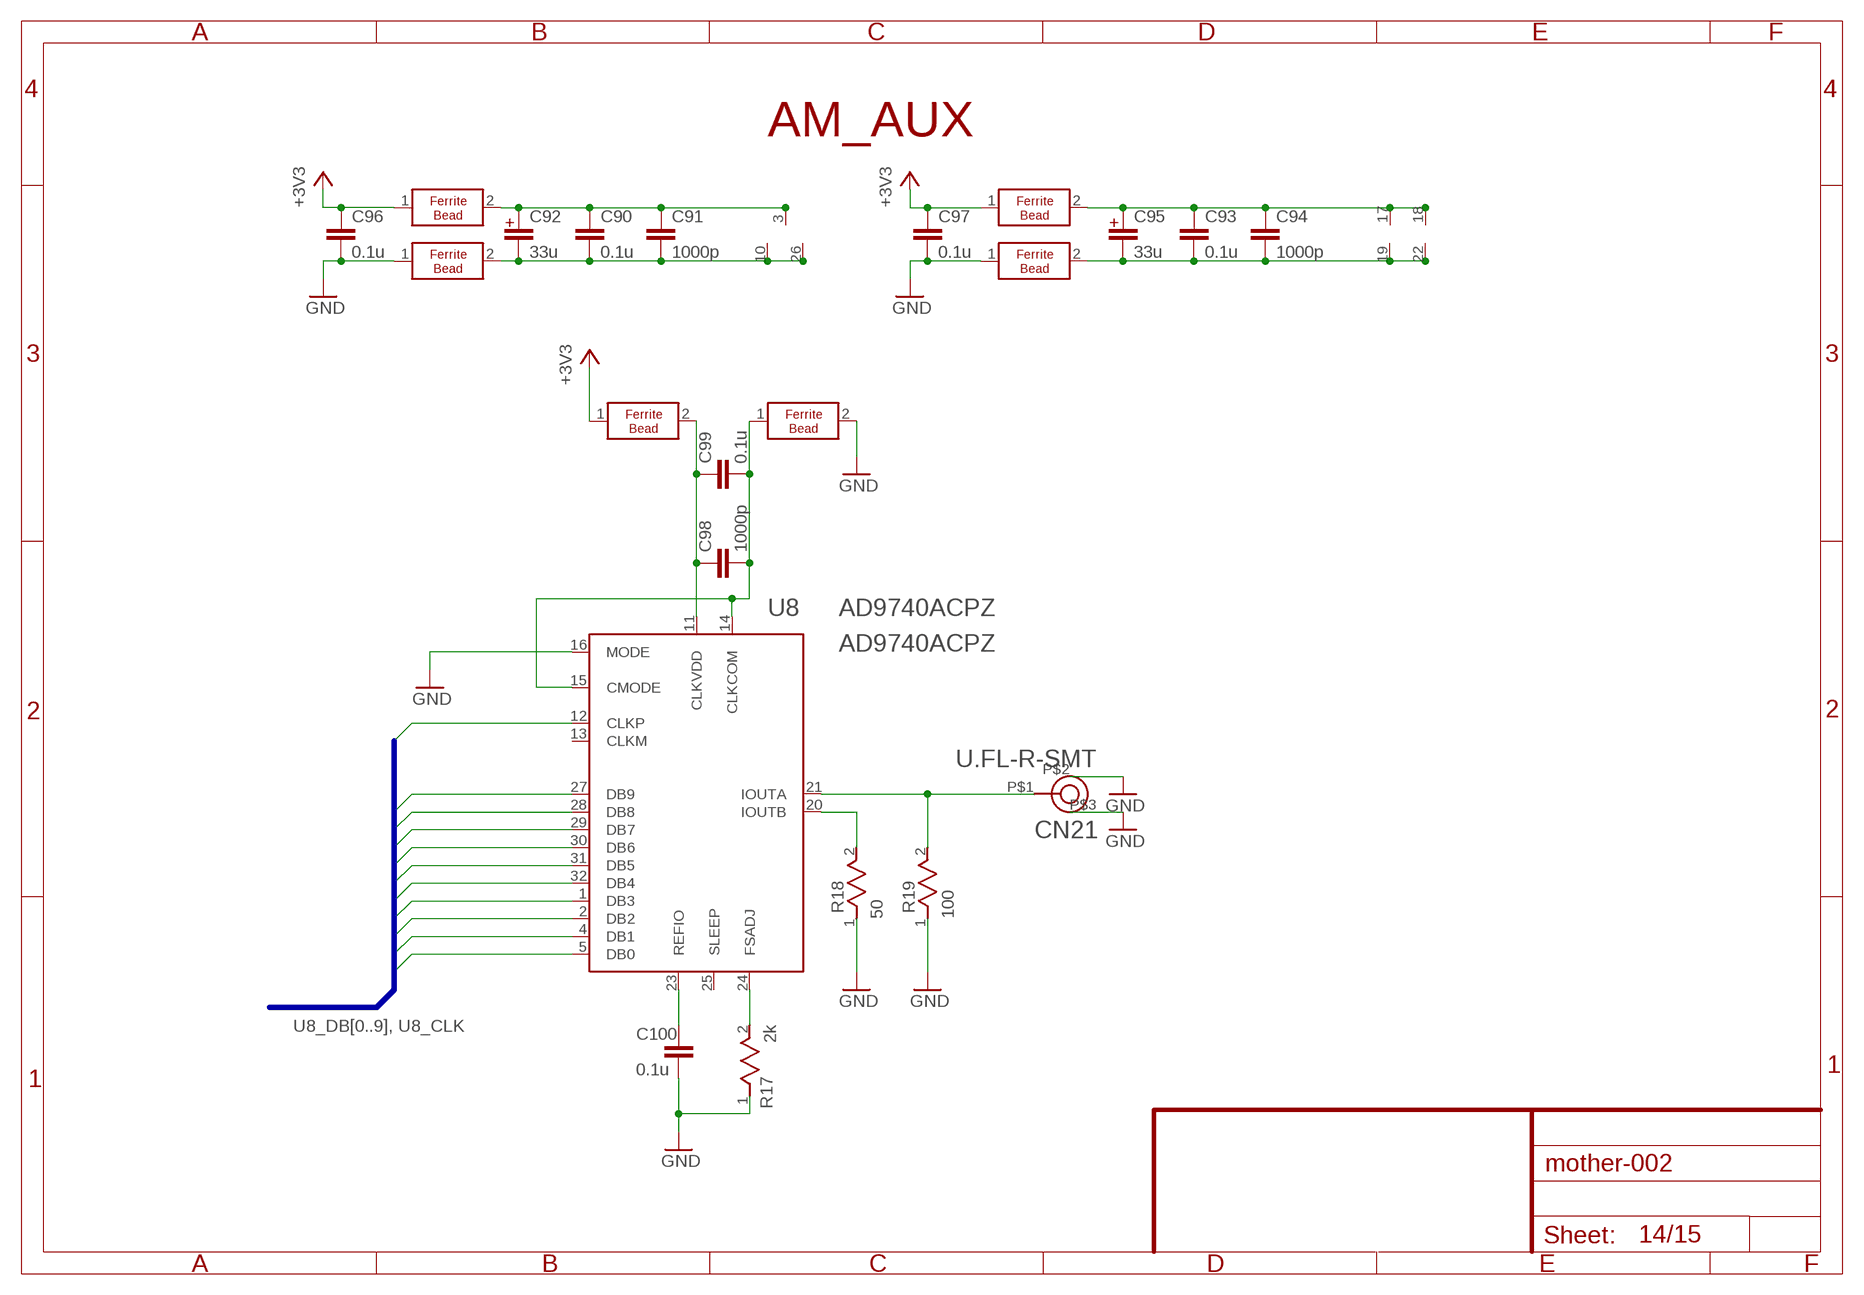
[diagram p13: schematic, sheet 14]

### Parts
C90  0.1u  C1005  [1005]
C91  1000p  C1005  [1005]
C92  33u  C_POLAR3216  [3216_POLAR]
C93  0.1u  C1005  [1005]
C94  1000p  C1005  [1005]
C95  33u  C_POLAR3216  [3216_POLAR]
C96  0.1u  C1005  [1005]
C97  0.1u  C1005  [1005]
C98  1000p  C1005  [1005]
C99  0.1u  C1005  [1005]
C100  0.1u  C1005  [1005]
CN21  U.FL-R-SMT  [U.FL-R-SMT]
FB41  FERRITEBEAD  [1608]
FB42  FERRITEBEAD  [1608]
FB43  FERRITEBEAD  [1608]
FB44  FERRITEBEAD  [1608]
FB45  FERRITEBEAD  [1608]
FB46  FERRITEBEAD  [1608]
R17  2k  R1005  [1005]
R18  50  R1005  [1005]
R19  100  R1005  [1005]
U8  AD9740ACPZ  AD9740  [AD9740ACP]

### Nets
A0_U8: C93.2 C94.2 C95.2 FB44.2 U8.19(AGND) U8.22(AGND)
A33_U8: C93.1 C94.1 C95.1 FB43.2 U8.17(AVDD) U8.18(AVDD)
AGND: C97.2 C100.2 CN21.P$2(AGND) CN21.P$3(AGND2) FB44.1 R17.1 R18.1 R19.1 ; supply symbol labelled GND ; also sheet 1,3,6,7,8,9,10,11,13
AVDD: C97.1 FB43.1 ; supply symbol labelled +3V3 ; also sheet 3,6,7,8,9,10,11,13
CLKGND_U8: C98.2 C99.2 FB46.1 U8.14(CLKCOM) U8.15(CMODE)
CLKVDD_U8: C98.1 C99.1 FB45.2 U8.11(CLKVDD)
D0_U8: C90.2 C91.2 C92.2 FB42.2 U8.10(DGND) U8.16(MODE) U8.26(DGND) ; supply symbol labelled GND
D33_U8: C90.1 C91.1 C92.1 FB41.2 U8.3(DVDD)
DGND: C96.2 FB42.1 FB46.2 ; supply symbol labelled GND ; also sheet 1,2,3,4,5,6,7,8,9,10,11,12,13
DVDD: C96.1 FB41.1 FB45.1 ; supply symbol labelled +3V3 ; also sheet 1,2,3,4,6,7,8,9,10,11,13
N$71: C100.1 U8.23(REFIO)
N$72: R17.2 U8.24(FSADJ)
N$73: R18.2 U8.20(IOUTB)
N$74: CN21.P$1 R19.2 U8.21(IOUTA)
U8_CLK: U8.12(CLKP) ; also sheet 1
U8_DB0: U8.5(DB0) ; also sheet 1
U8_DB1: U8.4(DB1) ; also sheet 1
U8_DB2: U8.2(DB2) ; also sheet 1
U8_DB3: U8.1(DB3) ; also sheet 1
U8_DB4: U8.32(DB4) ; also sheet 1
U8_DB5: U8.31(DB5) ; also sheet 1
U8_DB6: U8.30(DB6) ; also sheet 1
U8_DB7: U8.29(DB7) ; also sheet 1
U8_DB8: U8.28(DB8) ; also sheet 1
U8_DB9: U8.27(DB9) ; also sheet 1
Unconnected: U8.13(CLKM) U8.25(SLEEP)

### Buses
U8_DB[0..9],U8_CLK

### Notes on the sheet
- AM_AUX
- AD9740ACPZ
- U8_DB[0..9], U8_CLK

## Sheet 15 of 15

## Library data of the parts
C1 C2 C4 C5 C7-C11 C19 C20 C22 C23 C25-C29 C46 C47 C49 C50 C52-C58 C60 C61 C63-C69 C71 C72 C74-C80 C82 C83 C85-C91 C93 C94 C96-C100 = capacitor:C: CAPACITOR naming: grid - package width
C3 C6 C21 C24 C48 C51 C59 C62 C70 C73 C81 C84 C92 C95 = capacitor:C_POLAR
C12 C14 C16-C18 C32 C33 C36 C37 C40 C41 C44 C45 = myCapacitor:C: CAPACITOR naming: grid - package width
C13 C15 C30 C31 C34 C35 C38 C39 C42 C43 = myCapacitor:C_POLAR
CN1 CN2 = HIROSE:FX10A-80S/8-SV
CN3 CN4 = HIROSE:FX10A-100S/10-SV
CN5-CN7 CN16 CN17 = HIROSE:FH12-30S-0.5SH
CN8-CN15 CN21 = HIROSE:U.FL-R-SMT
CN18 = connector:SMA
CN19 CN20 = HIROSE:DF13-2P-1.25V
FB1-FB46 = ferriteBead:FERRITEBEAD
R1-R19 = resistor:R
T1-T4 = miniCircuits:TC1-1T+
U1-U6 U8 = AnalogDevices:AD9740
U7 = AnalogDevices:AD9245